# EAGLE design ton1 (EAGLE 7.4.0)
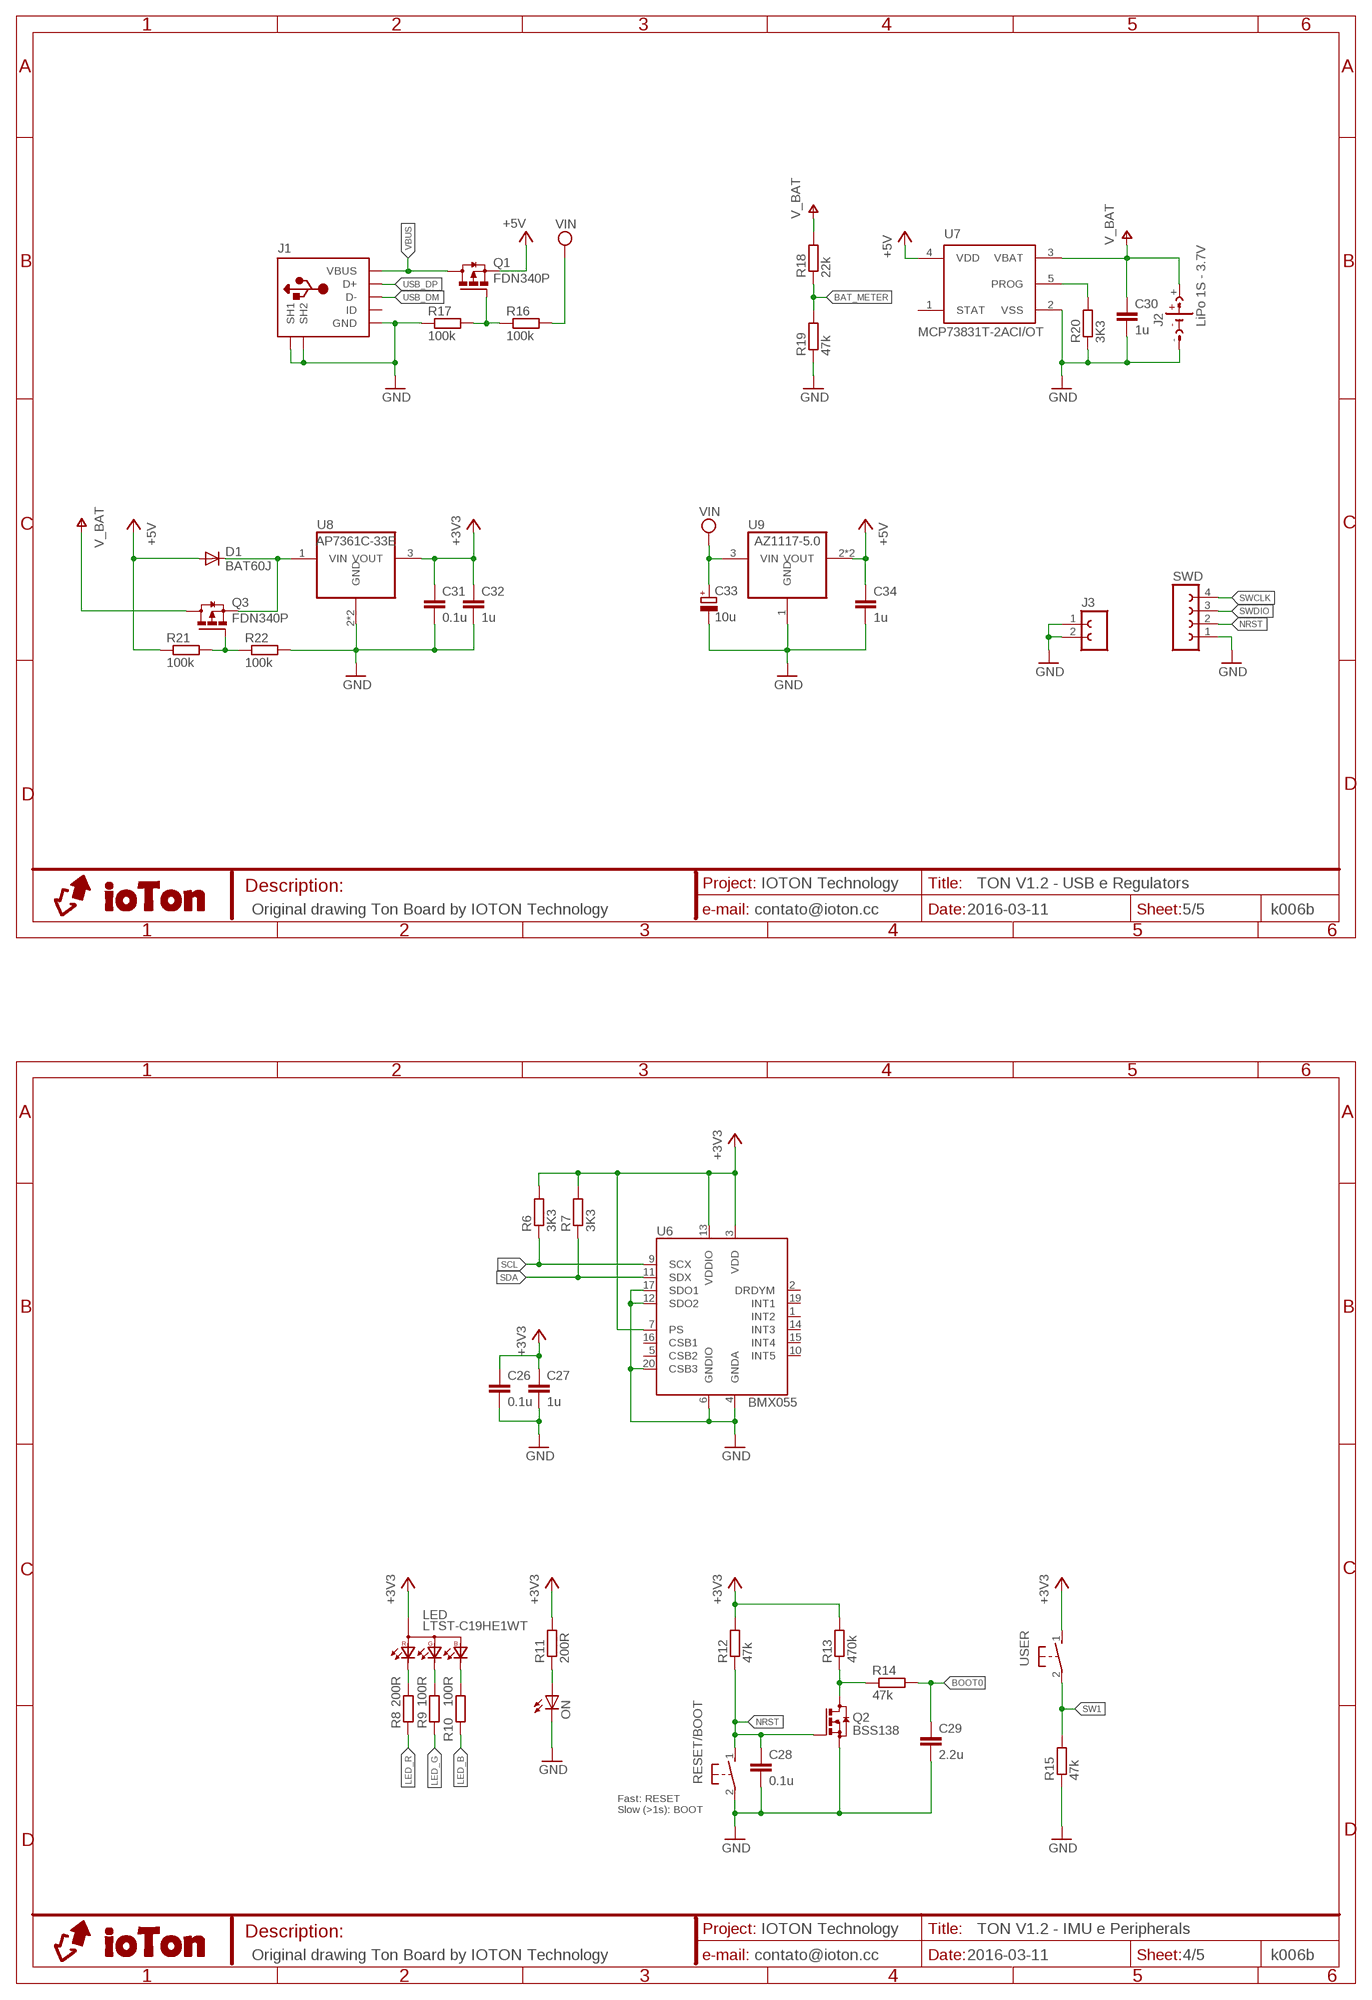
[diagram p0: schematic, sheet 1, part 1 of 3]
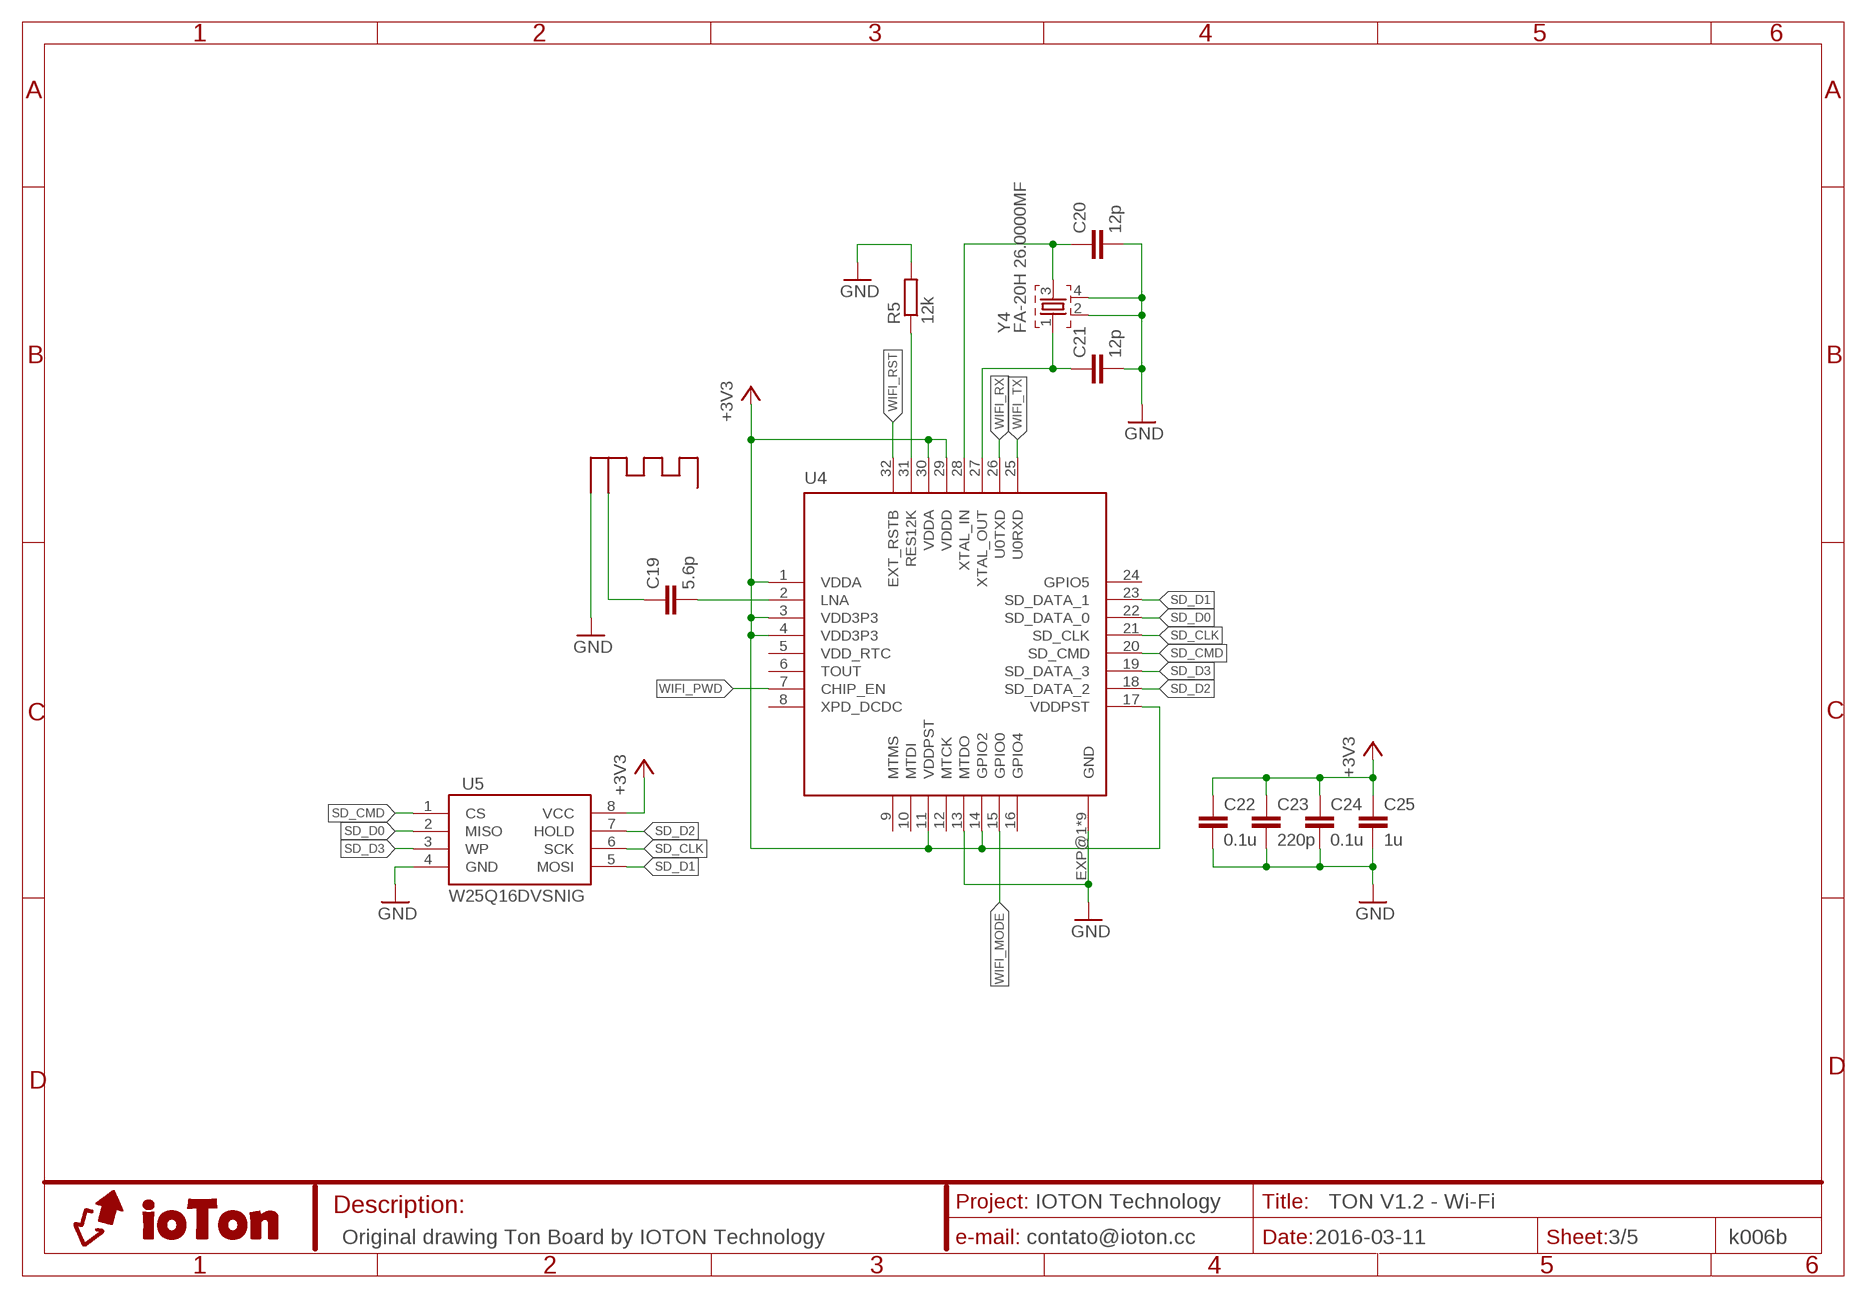
[diagram p1: schematic, sheet 1, part 2 of 3]
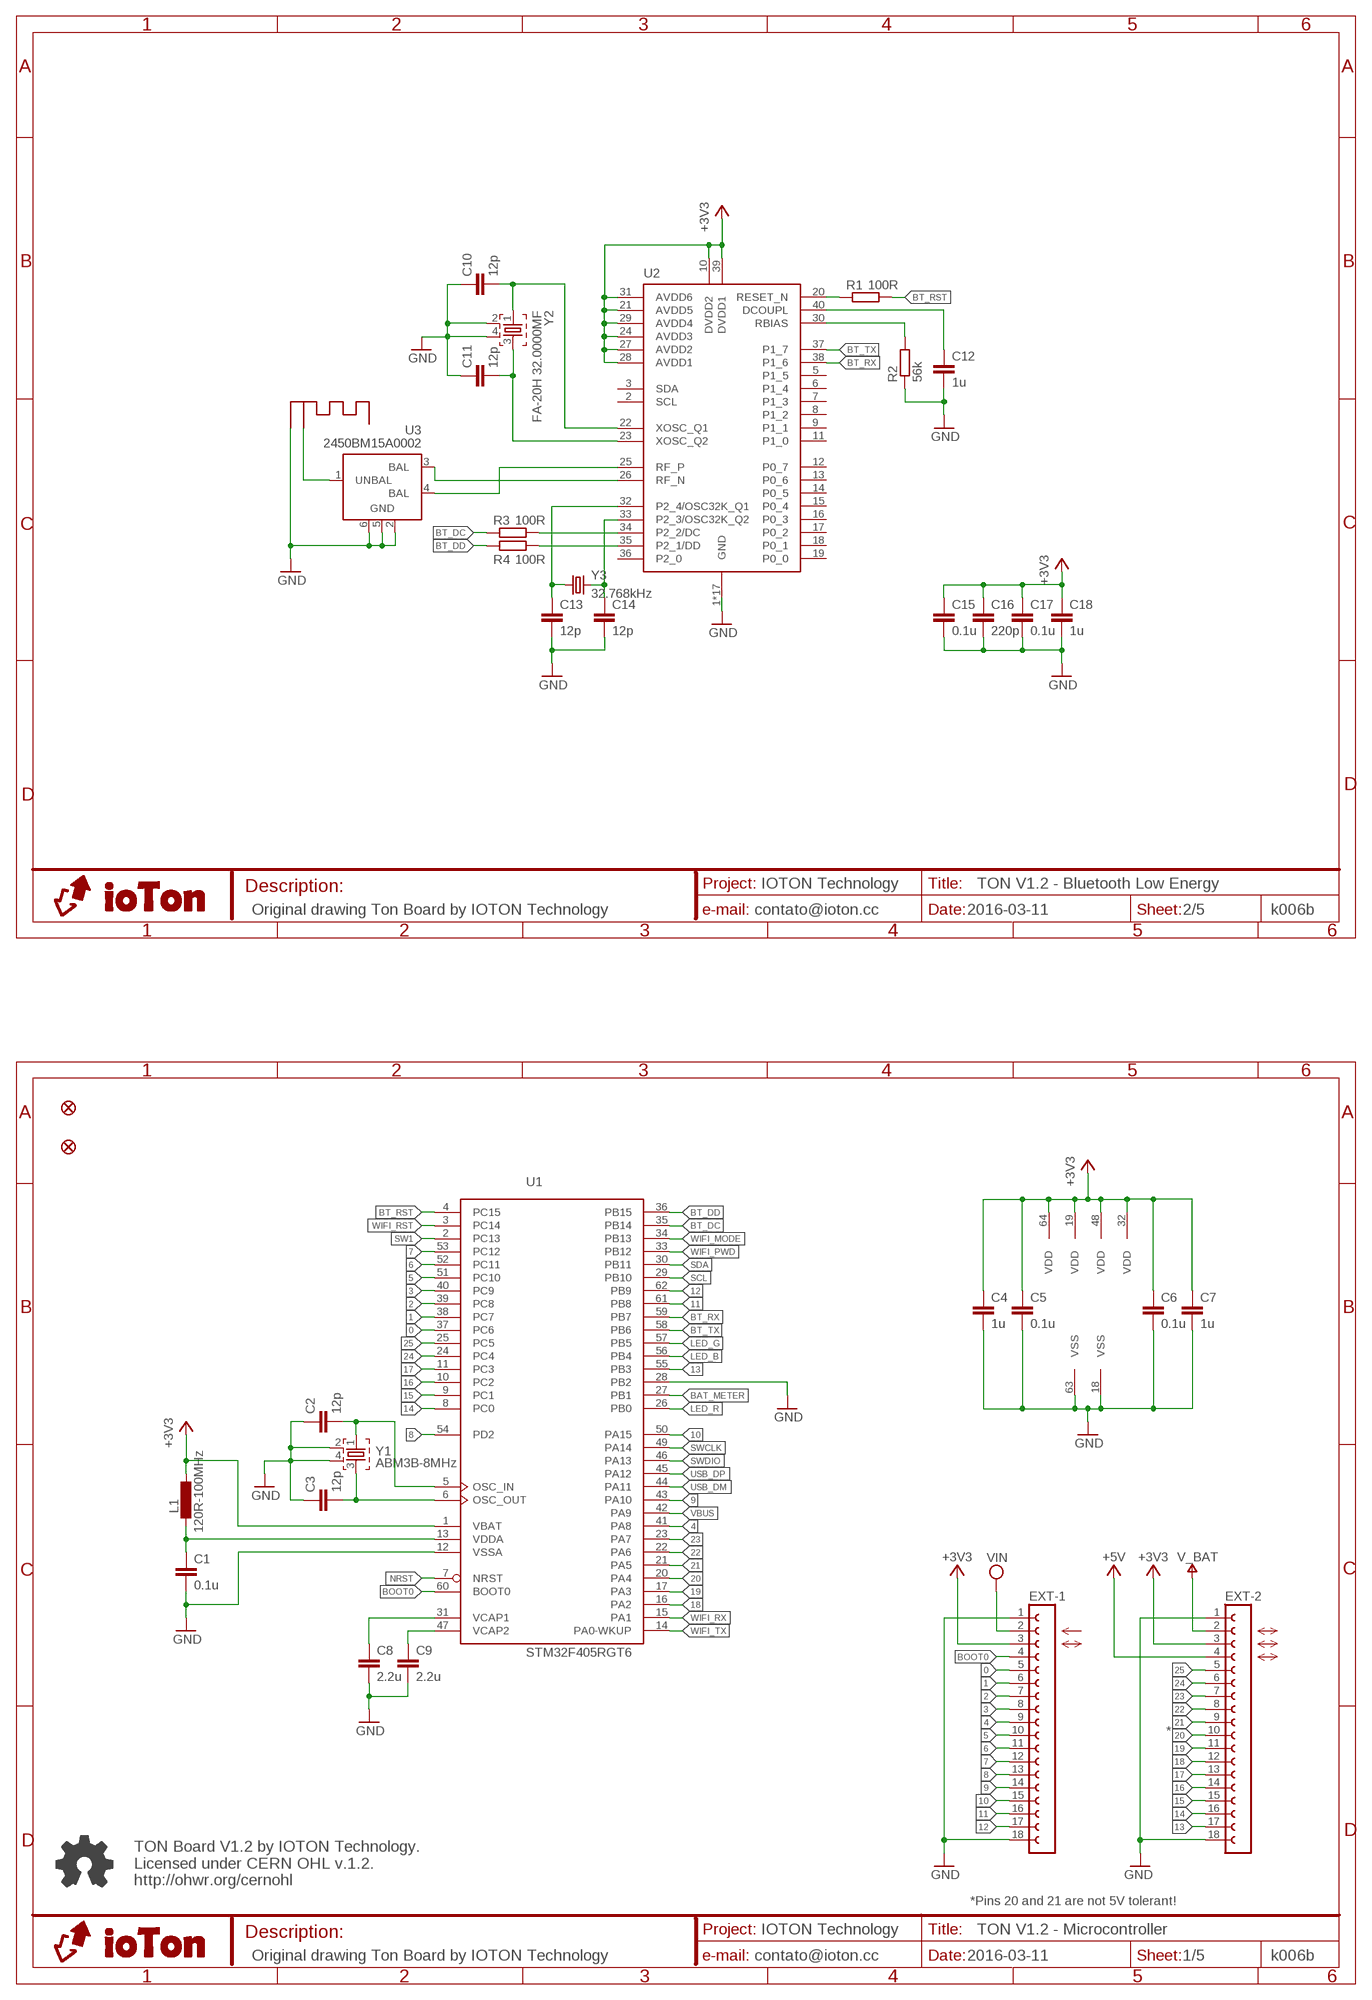
[diagram p2: schematic, sheet 1, part 3 of 3]

## Parts
C1  0.1u  C-EUC0603  [C0603]
C2  12p  C-EUC0402  [C0402]
C3  12p  C-EUC0402  [C0402]
C4  1u  C-EUC0603  [C0603]
C5  0.1u  C-EUC0603  [C0603]
C6  0.1u  C-EUC0603  [C0603]
C7  1u  C-EUC0603  [C0603]
C8  2.2u  C-EUC0603  [C0603]
C9  2.2u  C-EUC0603  [C0603]
C10  12p  C-EUC0402  [C0402]
C11  12p  C-EUC0402  [C0402]
C12  1u  C-EUC0402  [C0402]
C13  12p  C-EUC0402  [C0402]
C14  12p  C-EUC0402  [C0402]
C15  0.1u  C-EUC0402  [C0402]
C16  220p  C-EUC0402  [C0402]
C17  0.1u  C-EUC0402  [C0402]
C18  1u  C-EUC0402  [C0402]
C19  5.6p  C-EUC0402  [C0402]
C20  12p  C-EUC0402  [C0402]
C21  12p  C-EUC0402  [C0402]
C22  0.1u  C-EUC0402  [C0402]
C23  220p  C-EUC0402  [C0402]
C24  0.1u  C-EUC0402  [C0402]
C25  1u  C-EUC0402  [C0402]
C26  0.1u  C-EUC0603  [C0603]
C27  1u  C-EUC0603  [C0603]
C28  0.1u  C-EUC0603  [C0603]
C29  2.2u  C-EUC0603  [C0603]
C30  1u  C-EUC0603  [C0603]
C31  0.1u  C-EUC0603  [C0603]
C32  1u  C-EUC0603  [C0603]
C33  10u  CPOL-EUSMCA  [SMC_A]
C34  1u  C-EUC0603  [C0603]
D1  BAT60J  DIODE-SOD323-R  [SOD323-R]
EXT-1  1_18  [1_18]
EXT-2  1_18  [1_18]
J1  USBR  [0475890001]
J2  LiPo 1S - 3.7V  BATTERY  [BATTERY]
J3  1_2  [1_2]
JP1  FIDUCIAL1X2  [FIDUCIAL-1X2]
JP2  FIDUCIAL1X2  [FIDUCIAL-1X2]
L1  120R-100MHz  L-EULR0603  [LR0603]
LED  LTST-C19HE1WT  LED-RGB-AC  [0606]
ON  LEDCHIPLED_0603  [CHIPLED_0603]
Q1  FDN340P  FDN360P  [SUPER-SOT3]
Q2  BSS138  BSS123  [SOT23]
Q3  FDN340P  FDN360P  [SUPER-SOT3]
R1  100R  R-EU_R0402  [R0402]
R2  56k  R-EU_R0402  [R0402]
R3  100R  R-EU_R0402  [R0402]
R4  100R  R-EU_R0402  [R0402]
R5  12k  R-EU_R0402  [R0402]
R6  3K3  R-EU_R0603  [R0603]
R7  3K3  R-EU_R0603  [R0603]
R8  200R  R-EU_R0603  [R0603]
R9  100R  R-EU_R0603  [R0603]
R10  100R  R-EU_R0603  [R0603]
R11  200R  R-EU_R0603  [R0603]
R12  47k  R-EU_R0603  [R0603]
R13  470k  R-EU_R0603  [R0603]
R14  47k  R-EU_R0603  [R0603]
R15  47k  R-EU_R0603  [R0603]
R16  100k  R-EU_R0603  [R0603]
R17  100k  R-EU_R0603  [R0603]
R18  22k  R-EU_R0603  [R0603]
R19  47k  R-EU_R0603  [R0603]
R20  3K3  R-EU_R0603  [R0603]
R21  100k  R-EU_R0603  [R0603]
R22  100k  R-EU_R0603  [R0603]
RESET/BOOT  SWITCH  [SW_TL-3330]
SWD  FE04-11  [CON4-1_1]
U1  STM32F405RGT6  STM32F405RGT  [LQFP64]
U2  CC2541  [QFN40-6X6]
U3  2450BM15A0002  [2450BM15A0002]
U4  ESP8266O  [QFN32-5X5-O]
U5  W25Q16DVSNIG  SPI_FLASH-X25XXSMD  [SO08]
U6  BMX055  [LGA20-4.5X3]
U7  MCP73831T-2ACI/OT  MCP73831/OT  [SOT23-5L]
U8  AP7361C-33E  LDO-IGO  [SOT223]
U9  AZ1117-5.0  LM1117  [SOT223]
U$1  ANT_PCBR  [ANT_MIFA_R]
U$2  ANT_PCBL  [ANT_MIFA_L]
USER  SWITCH  [SW_TL-3330]
Y1  ABM3B-8MHz  FA-ABM3B  [ABM3B]
Y2  FA-20H 32.0000MF  FA-20H  [FA-20H]
Y3  32.768kHz  CRYSTAL_32.768K  [3.2X1.5]
Y4  FA-20H 26.0000MF  FA-20H  [FA-20H]

## Nets
0: EXT-1.5 U1.37(PC6)
1: EXT-1.6 U1.38(PC7)
2: EXT-1.7 U1.39(PC8)
3: EXT-1.8 U1.40(PC9)
4: EXT-1.9 U1.41(PA8)
5: EXT-1.10 U1.51(PC10)
6: EXT-1.11 U1.52(PC11)
7: EXT-1.12 U1.53(PC12)
8: EXT-1.13 U1.54(PD2)
9: EXT-1.14 U1.43(PA10)
10: EXT-1.15 U1.50(PA15)
11: EXT-1.16 U1.61(PB8)
12: EXT-1.17 U1.62(PB9)
13: EXT-2.17 U1.55(PB3)
14: EXT-2.16 U1.8(PC0)
15: EXT-2.15 U1.9(PC1)
16: EXT-2.14 U1.10(PC2)
17: EXT-2.13 U1.11(PC3)
18: EXT-2.12 U1.16(PA2)
19: EXT-2.11 U1.17(PA3)
20: EXT-2.10 U1.20(PA4)
21: EXT-2.9 U1.21(PA5)
22: EXT-2.8 U1.22(PA6)
23: EXT-2.7 U1.23(PA7)
24: EXT-2.6 U1.24(PC4)
25: EXT-2.5 U1.25(PC5)
+3V3: C4.1 C5.1 C6.1 C7.1 C15.1 C16.1 C17.1 C18.1 C22.1 C23.1 C24.1 C25.1 C26.1 C27.1 C31.1 C32.1 EXT-1.3 EXT-2.3 L1.2 LED.4(A) R6.2 R7.2 R11.2 R12.2 R13.2 U1.1(VBAT) U1.19(VDD) U1.32(VDD) U1.48(VDD) U1.64(VDD) U2.10(DVDD2) U2.21(AVDD5) U2.24(AVDD3) U2.27(AVDD2) U2.28(AVDD1) U2.29(AVDD4) U2.31(AVDD6) U2.39(DVDD1) U4.1(VDDA) U4.3(VDD3P3) U4.4(VDD3P3) U4.11(VDDPST) U4.14(GPIO2) U4.17(VDDPST) U4.29(VDDD) U4.30(VDDA) U5.8(VCC) U6.3(VDD) U6.7(PS) U6.13(VDDIO) U8.3(VOUT) USER.1
+5V: C34.1 D1.A EXT-2.4 Q1.2(S) R21.1 U7.4(VDD) U9.2(VOUT) U9.4(VOUT)
BAT_METER: R18.1 R19.2 U1.27(PB1)
BOOT0: C29.1 EXT-1.4 R14.2 U1.60(BOOT0)
BT_ANT: U3.1(UNBAL) U$2.ANT
BT_DC: R3.1 U1.35(PB14)
BT_DD: R4.1 U1.36(PB15)
BT_RST: R1.2 U1.4(PC15)
BT_RX: U1.59(PB7) U2.38(P1_6)
BT_TX: U1.58(PB6) U2.37(P1_7)
GND: C1.2 C2.1 C3.1 C4.2 C5.2 C6.2 C7.2 C8.2 C9.2 C10.1 C11.1 C12.2 C13.2 C14.2 C15.2 C16.2 C17.2 C18.2 C20.2 C21.2 C22.2 C23.2 C24.2 C25.2 C26.2 C27.2 C28.2 C29.2 C30.2 C31.2 C32.2 C33.- C34.2 EXT-1.1 EXT-1.18 EXT-2.1 EXT-2.18 J1.5(GND) J1.SH1 J1.SH2(SH1) J1.SH3(SH2) J1.SH4(SH2) J1.SH5(SH1) J1.SH6(SH2) J2.- J3.1 J3.2 ON.C Q2.2(S) R2.1 R5.2 R15.1 R17.1 R19.1 R20.1 R22.2 RESET/BOOT.2 SWD.1 U1.12(VSSA) U1.18(VSS) U1.28(PB2) U1.63(VSS) U2.1(GND) U2.EXP@1(GND) U2.EXP@2(GND) U2.EXP@3(GND) U2.EXP@4(GND) U2.EXP@5(GND) U2.EXP@6(GND) U2.EXP@7(GND) U2.EXP@8(GND) U2.EXP@9(GND) U2.EXP@10(GND) U2.EXP@11(GND) U2.EXP@12(GND) U2.EXP@13(GND) U2.EXP@14(GND) U2.EXP@15(GND) U2.EXP@16(GND) U3.2(GND) U3.5(GND) U3.6(GND) U4.13(MTDO) U4.EXP@1(GND) U4.EXP@2(GND) U4.EXP@3(GND) U4.EXP@5(GND) U4.EXP@6(GND) U4.EXP@7(GND) U4.EXP@9(GND) U4.EXP@10(GND) U4.EXP@11(GND) U5.4(GND) U6.4(GNDA) U6.6(GNDIO) U6.12(SDO2) U6.17(SDO1) U6.20(CSB3) U7.2(VSS) U8.2(GND) U8.4(GND) U9.1(GND) U$1.GND U$2.GND Y1.2 Y1.4 Y2.2 Y2.4 Y4.2 Y4.4
LED_B: R10.1 U1.56(PB4)
LED_G: R9.1 U1.57(PB5)
LED_R: R8.1 U1.26(PB0)
N$1: C2.2 U1.5(OSC_IN) Y1.1
N$2: C3.2 U1.6(OSC_OUT) Y1.3
N$3: C13.1 U2.32(P2_4/OSC32K_Q1) Y3.1
N$4: LED.1(KRED) R8.2
N$5: C8.1 U1.31(VCAP1)
N$6: C9.1 U1.47(VCAP2)
N$7: LED.2(KGREEN) R9.2
N$8: LED.3(KBLUE) R10.2
N$9: C1.1 L1.1 U1.13(VDDA)
N$10: R5.1 U4.31(RES12K)
N$11: C21.1 U4.27(XTAL_OUT) Y4.1
N$12: U2.26(RF_N) U3.3(BAL)
N$13: R2.2 U2.30(RBIAS)
N$14: C12.1 U2.40(DCOUPL)
N$15: U2.25(RF_P) U3.4(BAL)
N$16: R3.2 U2.34(P2_2/DC)
N$17: C20.1 U4.28(XTAL_IN) Y4.3
N$18: R20.2 U7.5(PROG)
N$19: C10.2 U2.22(XOSC_Q1) Y2.1
N$20: C11.2 U2.23(XOSC_Q2) Y2.3
N$21: R4.2 U2.35(P2_1/DD)
N$22: R1.1 U2.20(RESET_N)
N$23: C19.2 U4.2(LNA)
N$24: C14.1 U2.33(P2_3/OSC32K_Q2) Y3.2
N$25: ON.A R11.1
N$26: Q1.1(G) R16.1 R17.2
N$27: Q2.3(D) R13.1 R14.1
N$28: Q3.1(G) R21.2 R22.1
NRST: C28.1 Q2.1(G) R12.1 RESET/BOOT.1 SWD.2 U1.7(NRST)
SCL: R6.1 U1.29(PB10) U6.9(SCX)
SD_CLK: U4.21(SD_CLK) U5.6(SCK)
SD_CMD: U4.20(SD_CMD) U5.1(CS)
SD_D0: U4.22(SD_DATA_0) U5.2(MISO)
SD_D1: U4.23(SD_DATA_1) U5.5(MOSI)
SD_D2: U4.18(SD_DATA_2) U5.7(HOLD)
SD_D3: U4.19(SD_DATA_3) U5.3(WP)
SDA: R7.1 U1.30(PB11) U6.11(SDX)
SW1: R15.2 U1.2(PC13) USER.2
SWCLK: SWD.4 U1.49(PA14)
SWDIO: SWD.3 U1.46(PA13)
USB_DM: J1.2(D-) U1.44(PA11)
USB_DP: J1.3(D+) U1.45(PA12)
V+: C30.1 EXT-2.2 J2.+ Q3.3(D) R18.2 U7.3(VBAT) ; supply symbol labelled V_BAT
VBUS: J1.1(VBUS) Q1.3(D) U1.42(PA9)
VIN_3V3: D1.C Q3.2(S) U8.1(VIN)
VPP: C33.+ EXT-1.2 R16.2 U9.3(VIN) ; supply symbol labelled VIN
WIFI_ANT: C19.1 U$1.ANT
WIFI_MODE: U1.34(PB13) U4.15(GPIO0)
WIFI_PWD: U1.33(PB12) U4.7(CHIP_EN)
WIFI_RST: U1.3(PC14) U4.32(EXT_RSTB)
WIFI_RX: U1.15(PA1) U4.26(U0TXD)
WIFI_TX: U1.14(PA0-WKUP) U4.25(U0RXD)
Unconnected: J1.4(ID) U2.2(SCL) U2.3(SDA) U2.5(P1_5) U2.6(P1_4) U2.7(P1_3) U2.8(P1_2) U2.9(P1_1) U2.11(P1_0) U2.12(P0_7) U2.13(P0_6) U2.14(P0_5) U2.15(P0_4) U2.16(P0_3) U2.17(P0_2) U2.18(P0_1) U2.19(P0_0) U2.36(P2_0) U4.6(TOUT) U4.8(XPD_DCDC) U4.9(MTMS) U4.10(MTDI) U4.12(MTCK) U4.16(GPIO4) U4.24(GPIO5) U6.1(INT2) U6.2(DRDYM) U6.5(CSB2) U6.10(INT5) U6.14(INT3) U6.15(INT4) U6.16(CSB1) U6.19(INT1) U7.1(STAT)

## Notes on the sheet
- TON V1.2 - USB e Regulators
- Original drawing Ton Board by IOTON Technology | k006b
- Fast: RESET
  Slow (>1s): BOOT
- TON V1.2 - IMU e Peripherals
- Original drawing Ton Board by IOTON Technology | k006b
- TON V1.2 - Wi-Fi
- Original drawing Ton Board by IOTON Technology | k006b
- TON V1.2 - Bluetooth Low Energy
- Original drawing Ton Board by IOTON Technology | k006b
- *
- TON Board V1.2 by IOTON Technology.
  Licensed under CERN OHL v.1.2.
  http://ohwr.org/cernohl
- *Pins 20 and 21 are not 5V tolerant!
- TON V1.2 - Microcontroller
- Original drawing Ton Board by IOTON Technology | k006b

## Power pins joined to a net without a drawn wire
VDD_RTC: U4.5(VDD_RTC)

## Library data of the parts
C1-C32 C34 = rcl:C-EU: CAPACITOR, European symbol
C33 = rcl:CPOL-EU: POLARIZED CAPACITOR, European symbol
D1 = diode:DIODE-: DIODE
EXT-1 EXT-2 = ioton:1_18
J1 = ioton:USB: Hirose MicroUSB A/B Connector
J2 = pololu:BATTERY: BATTERY CLIP
J3 = ioton:1_2
JP1 JP2 = SparkFun:FIDUCIAL: Fiducial Alignment Points Various fiducial points for machine vision alignment.
L1 = rcl:L-EU: INDUCTOR, European symbol
LED = pololu:LED-RGB-AC
ON = led:LED: LED OSRAM: - CHIPLED LG R971, LG N971, LY N971, LG Q971, LY Q971, LO R971, LY R971 LH N974, LH R974 LS Q976, LO Q976, LY Q976 LO Q996 - Hyper CHIPLED LW Q18S LB Q993, LB Q99A, LB R99A - SideLED LS A670, LO A670, LY A670, LG A670, LP A670 LB A673, LV A673, LT A673, LW A673 LH A674 LY A675 LS A676, LA A676, LO A676, LY A676, LW A676 LS A679, LY A679, LG A679 - Hyper Micro SIDELED® LS Y876, LA Y876, LO Y876, LY Y876 LT Y87S - SmartLED LW L88C, LW L88S LB L89C, LB L89S, LG L890 LS L89K, LO L89K, LY L89K LS L896, LA L896, LO L896, LY L896 - TOPLED LS T670, LO T670, LY T670, LG T670, LP T670 LSG T670, LSP T670, LSY T670, LOP T670, LYG T670 LG T671, LOG T671, LSG T671 LB T673, LV T673, LT T673, LW T673 LH T674 LS T676, LA T676, LO T676, LY T676, LB T676, LH T676, LSB T676, LW T676 LB T67C, LV T67C, LT T67C, LS T67K, LO T67K, LY T67K, LW E67C LS E67B, LA E67B, LO E67B, LY E67B, LB E67C, LV E67C, LT E67C LW T67C LS T679, LY T679, LG T679 LS T770, LO T770, LY T770, LG T770, LP T770 LB T773, LV T773, LT T773, LW T773 LH T774 LS E675, LA E675, LY E675, LS T675 LS T776, LA T776, LO T776, LY T776, LB T776 LHGB T686 LT T68C, LB T68C - Hyper Mini TOPLED® LB M676 - Mini TOPLED Santana® LG M470 LS M47K, LO M47K, LY M47K Source: http://www.osram.convergy.de LUXEON: - LUMILED® LXK2-PW12-R00, LXK2-PW12-S00, LXK2-PW14-U00, LXK2-PW14-V00 LXK2-PM12-R00, LXK2-PM12-S00, LXK2-PM14-U00 LXK2-PE12-Q00, LXK2-PE12-R00, LXK2-PE12-S00, LXK2-PE14-T00, LXK2-PE14-U00 LXK2-PB12-K00, LXK2-PB12-L00, LXK2-PB12-M00, LXK2-PB14-N00, LXK2-PB14-P00, LXK2-PB14-Q00 LXK2-PR12-L00, LXK2-PR12-M00, LXK2-PR14-Q00, LXK2-PR14-R00 LXK2-PD12-Q00, LXK2-PD12-R00, LXK2-PD12-S00 LXK2-PH12-R00, LXK2-PH12-S00 LXK2-PL12-P00, LXK2-PL12-Q00, LXK2-PL12-R00 Source: www.luxeon.com KINGBRIGHT: KA-3528ASYC Source: www.kingbright.com
Q1 Q3 = transistor-power:FDN360P: Single P-Channel, PowerTrench (R) MOSFET Source: http://www.fairchildsemi.com/ds/FD/FDN360P.pdf
Q2 = transistor-small-signal:BSS123: N-CHANNEL MOS FET
R1-R22 = rcl:R-EU_: RESISTOR, European symbol
RESET/BOOT USER = ioton:SWITCH
SWD = pololu:FE04-1
U1 = micro-stm_v2:STM32F405R*T: ARM 32-bit Cortex™-M3 CPU 168 MHz maximum frequency 1024 Kbytes of Flash memory 192 kbytes of SRAM 51 GPIOs 1.8 to 3.6 V application supply
U2 = ioton:CC2541
U3 = johanson-technology:2450BM15A0002: 2.45 GHz Impedance Matched Balun-Filter For TI CC253X/CC2540 Chipset family Data sheet <http://www.johansontechnology.com/images/stories/ip/baluns/balun_filter_combo_matched_2450bm15a0002_v8.pdf>
U4 = ioton:ESP8266
U5 = SparkFun:SPI_FLASH-X25XX: 8pin SPI Flash series x25xx. Works with devices like W25X32 and BR25L32
U6 = ioton:BMX055
U7 = adafruit:MCP73831: MCP73831/2 Miniature Single-Cell, Fully Integrated Li-Ion, Li-Polymer Charge Management Controllers. Nice and small simple lipoly charge controller, with adjustable current and status output (LED) http://www.ladyada.net/library/pcb/eaglelibrary.html
U8 = pololu:LDO-IGO
U9 = pololu:LM1117: 800mA and 1A Low Dropout (LDO) Positive Regulator 1.8V, 2.5V, 2.85V, 3.3V, 5V, and Adj; MPN: REG1117; OC_FARNELL: 1097566; OC_NEWARK: 14P6981
U$1 U$2 = ioton:ANT_PCB
Y1 = ioton:FA-: MHz RANGE CRYSTAL UNIT Source: Epson Toyocom
Y2 Y4 = crystal:FA-: MHz RANGE CRYSTAL UNIT Source: Epson Toyocom
Y3 = ioton:CRYSTAL_32.768K

## Board
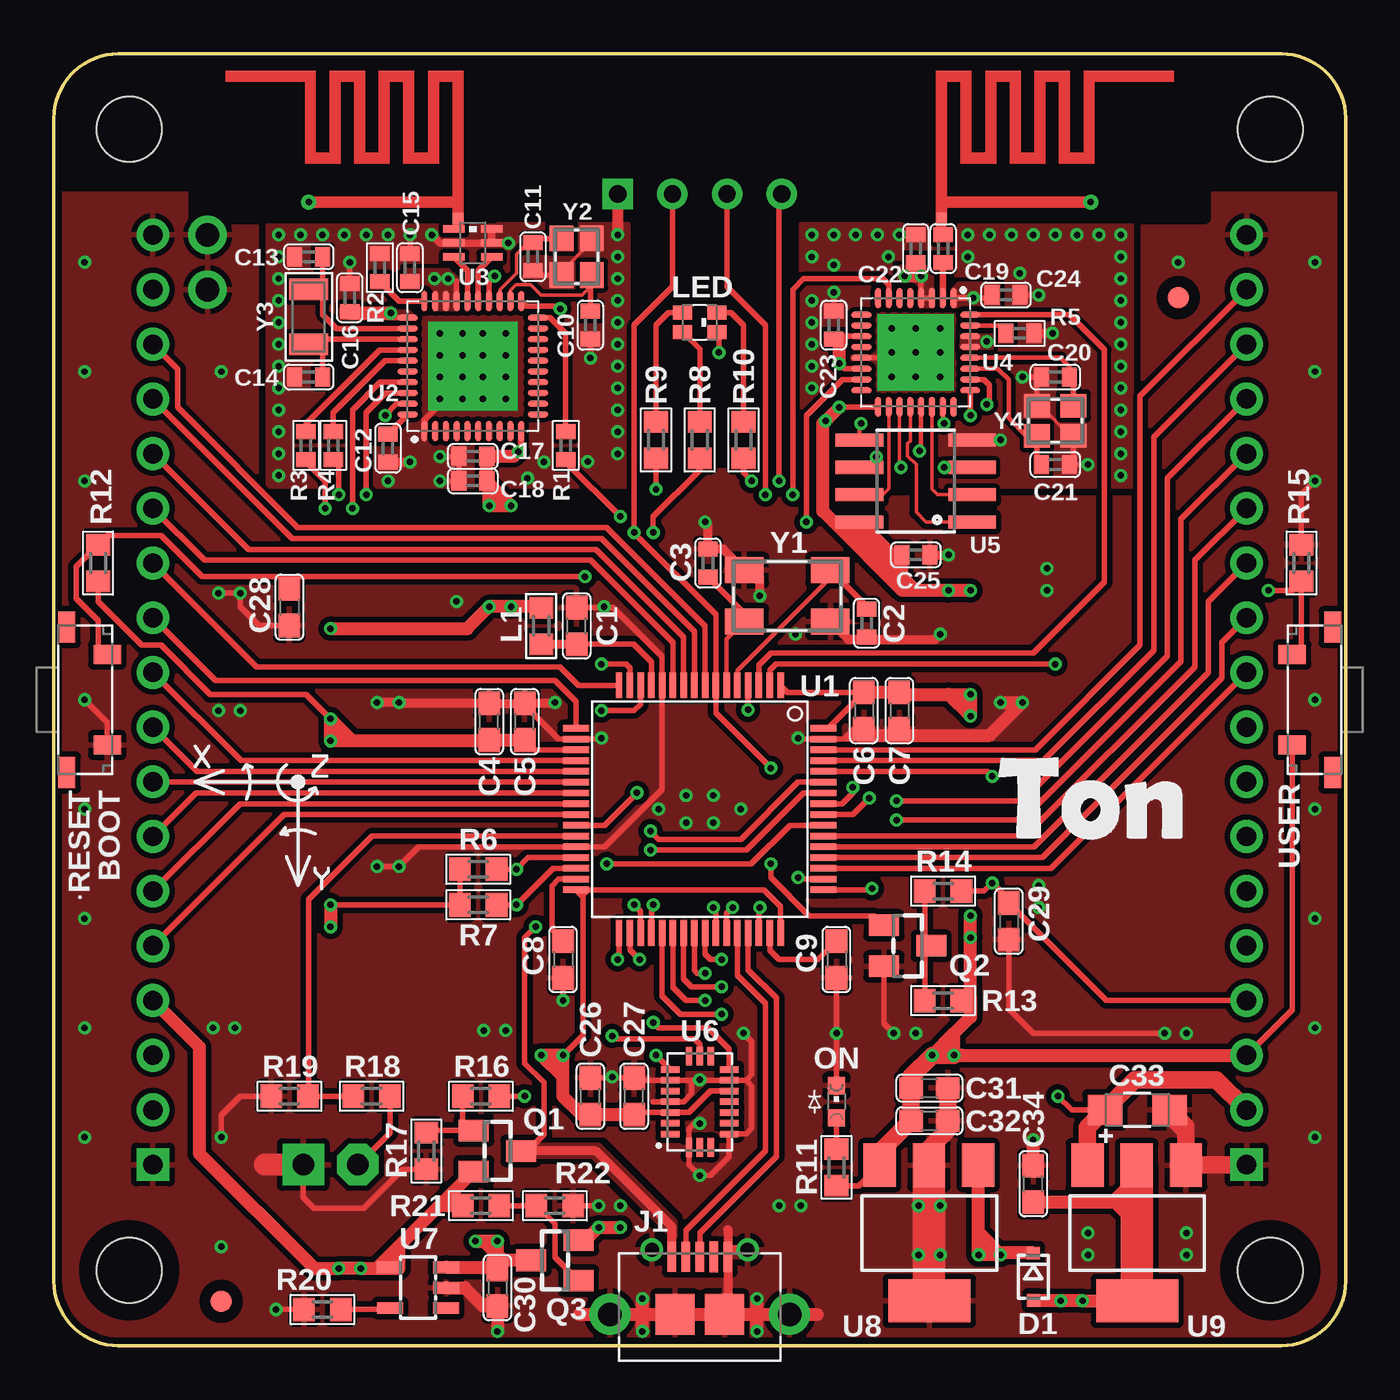
[diagram p3: board, top side]
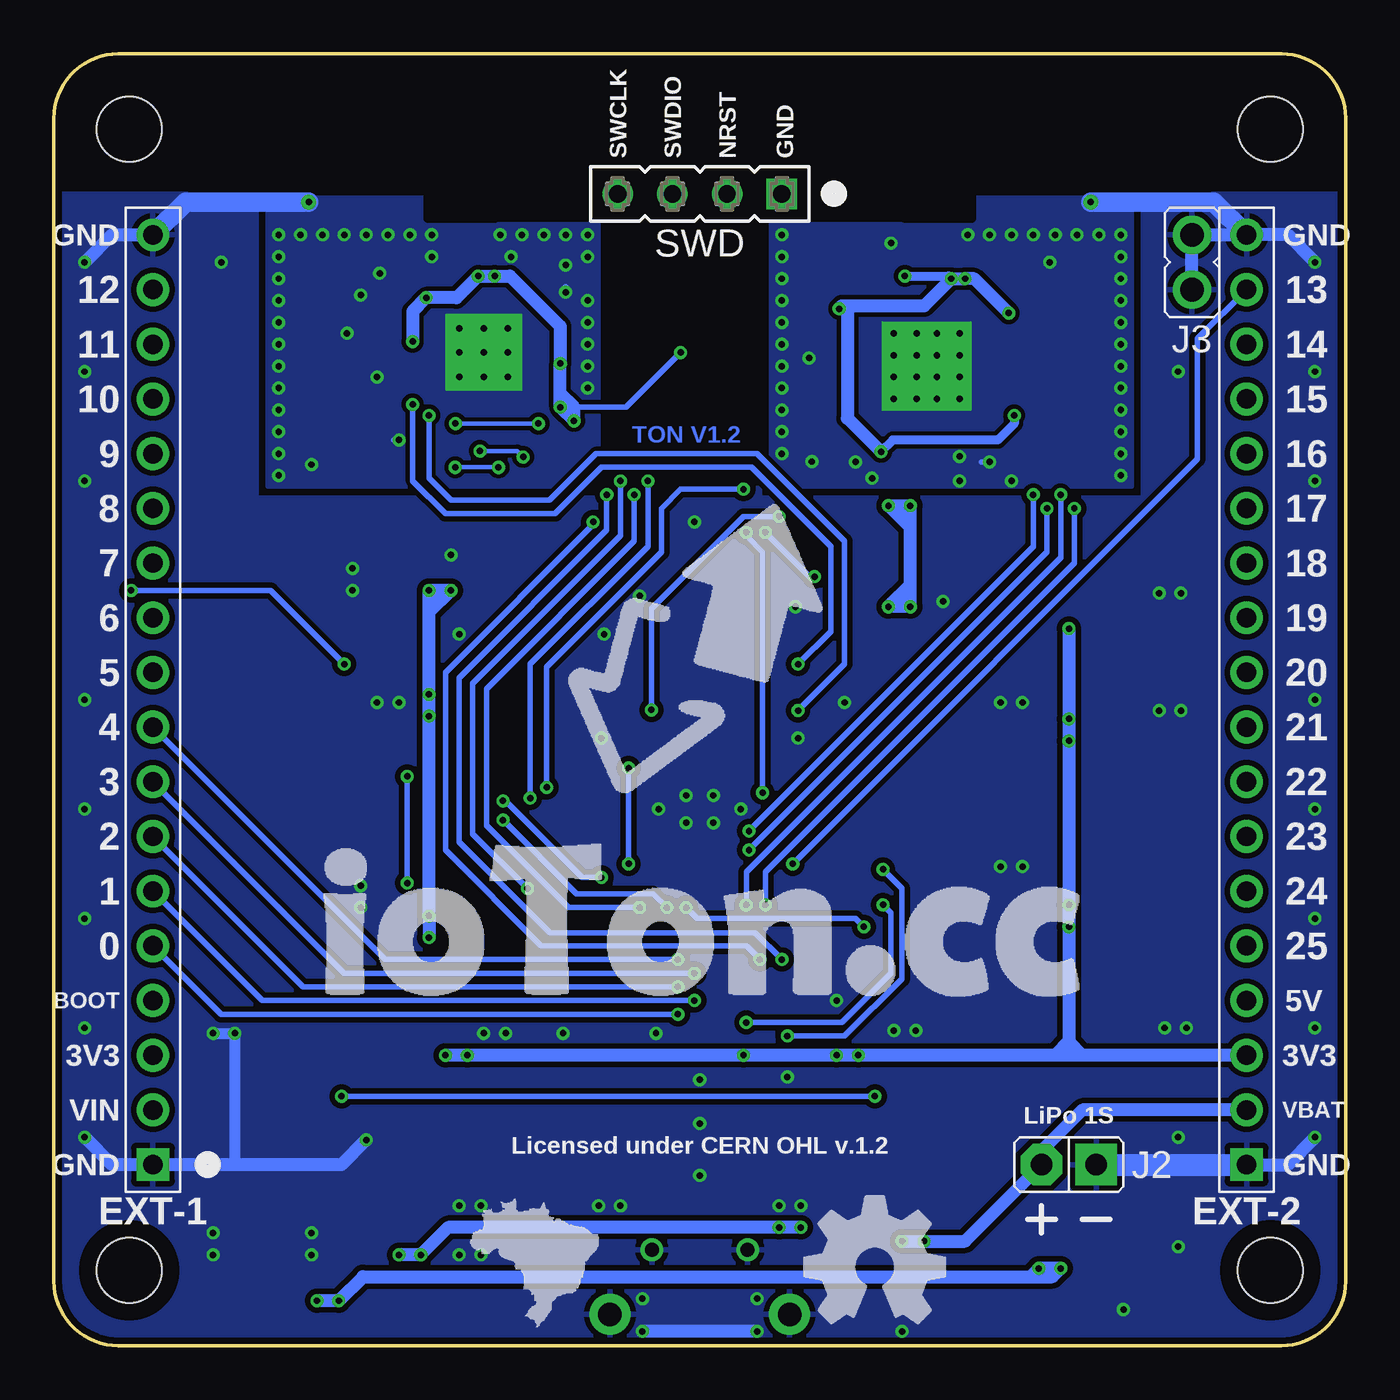
[diagram p4: board, bottom side, seen from below]

Size 60 x 60 mm. Coordinates in mm from the lower left corner, seen from the top.
Outline: 57,0 3,0 arc-90 0,3 0,57 arc-90 3,60 57,60 arc-90 60,57 60,3 arc-90 57,0
Copper layers (1*16): Top 0.035mm / dielectric 1.5mm / Bottom 0.035mm
Design rules "default *": minimum track width 6mil, minimum drill 10mil, track to track 8mil, track to pad 7mil, pad to pad 6mil, via to via 7mil, smd to smd 0mil, copper to edge 12mil, drill to drill 8mil, minimum pad ring 8mil, minimum via ring 6mil, stop-mask expansion 4mil, vias tented up to drill 19mil, thermal gap 10mil
Holes 3 mm at 3.5,3.5 3.5,56.5 56.5,56.5 56.5,3.5
tRestrict: area 1.5,1.5 to 5.5,5.5; area 54.5,1.5 to 58.5,5.5; area 51.5,47.9 to 53,49.4; area 7,1.3 to 8.5,2.8
bRestrict: area 1.5,1.5 to 5.5,5.5; area 54.5,1.5 to 58.5,5.5

### Footprints (pad centres in the part's own frame; a part is rotated, then mirrored left to right if it is on the bottom)
C0603 = smd 1.1 x 1: 1 -0.85,0; 2 0.85,0
C0402 = smd 0.7 x 0.9: 1 -0.65,0; 2 0.65,0
SMC_A = smd 1.6 x 1.4: + -1.5,0; - 1.5,0
SOD323-R = smd 0.6 x 0.6: A 1.1,0; C -1.1,0
1_18 = drill 0.9 pad 1.524 square: 1 -21.59,0 | drill 0.9 pad 1.524: 2 -19.05,0; 3 -16.51,0; 4 -13.97,0; 5 -11.43,0; 6 -8.89,0; 7 -6.35,0; 8 -3.81,0; 9 -1.27,0; 10 1.27,0; 11 3.81,0; 12 6.35,0; 13 8.89,0; 14 11.43,0; 15 13.97,0; 16 16.51,0; 17 19.05,0; 18 21.59,0
0475890001 = smd 0.4 x 1.4: 1 -1.3,2.675; 2 -0.65,2.675; 3 0,2.675; 4 0.65,2.675; 5 1.3,2.675 | drill 1.1 pad 1.9: SH1 -4.175,0; SH4 4.175,0 | smd 1.8 x 1.9: SH2 -1.15,0; SH3 1.15,0 | drill 0.65 pad 1.05: SH5 -2.225,3; SH6 2.225,3
BATTERY = drill 1 pad 1.93 octagon: + 0,1.27 | drill 1 pad 1.93 square: - 0,-1.27
1_2 = drill 1.1 pad 1.778: 1 -1.27,0; 2 1.27,0
FIDUCIAL-1X2 = smd 1 x 1: 1 0,0
LR0603 = smd 1 x 1.1: 1 -0.85,0; 2 0.85,0
0606 = smd 0.65 x 0.9: 1 -0.45,0.8; 2 0.45,0.8; 3 0.45,-0.8; 4 -0.45,-0.8
CHIPLED_0603 = smd 0.8 x 0.8: A 0,-0.75; C 0,0.75
SUPER-SOT3 = smd 1 x 1.4: 1 -0.95,-1.1; 2 0.95,-1.1; 3 0,1.1
SOT23 = smd 1 x 1.4: 1 -0.95,-1.1; 2 0.95,-1.1; 3 0,1.1
R0402 = smd 0.7 x 0.9: 1 -0.65,0; 2 0.65,0
R0603 = smd 1 x 1.1: 1 -0.85,0; 2 0.85,0
SW_TL-3330 = smd 0.9 x 1.27: 1 -2.1,0.885; 2 2.1,0.885 | smd 1.45 x 0.8: 3 -3.375,-1; 4 3.375,-1
CON4-1_1 = drill 0.8 pad 1.422 square: 1 -3.81,0 | drill 0.8 pad 1.422: 2 -1.27,0; 3 1.27,0; 4 3.81,0
LQFP64 = smd 0.3 x 1.2: 1 -3.75,-5.75; 2 -3.25,-5.75; 3 -2.75,-5.75; 4 -2.25,-5.75; 5 -1.75,-5.75; 6 -1.25,-5.75; 7 -0.75,-5.75; 8 -0.25,-5.75; 9 0.25,-5.75; 10 0.75,-5.75; 11 1.25,-5.75; 12 1.75,-5.75; 13 2.25,-5.75; 14 2.75,-5.75; 15 3.25,-5.75; 16 3.75,-5.75; 33 3.75,5.75; 34 3.25,5.75; 35 2.75,5.75; 36 2.25,5.75; 37 1.75,5.75; 38 1.25,5.75; 39 0.75,5.75; 40 0.25,5.75; 41 -0.25,5.75; 42 -0.75,5.75; 43 -1.25,5.75; 44 -1.75,5.75; 45 -2.25,5.75; 46 -2.75,5.75; 47 -3.25,5.75; 48 -3.75,5.75 | smd 1.2 x 0.3: 17 5.75,-3.75; 18 5.75,-3.25; 19 5.75,-2.75; 20 5.75,-2.25; 21 5.75,-1.75; 22 5.75,-1.25; 23 5.75,-0.75; 24 5.75,-0.25; 25 5.75,0.25; 26 5.75,0.75; 27 5.75,1.25; 28 5.75,1.75; 29 5.75,2.25; 30 5.75,2.75; 31 5.75,3.25; 32 5.75,3.75; 49 -5.75,3.75; 50 -5.75,3.25; 51 -5.75,2.75; 52 -5.75,2.25; 53 -5.75,1.75; 54 -5.75,1.25; 55 -5.75,0.75; 56 -5.75,0.25; 57 -5.75,-0.25; 58 -5.75,-0.75; 59 -5.75,-1.25; 60 -5.75,-1.75; 61 -5.75,-2.25; 62 -5.75,-2.75; 63 -5.75,-3.25; 64 -5.75,-3.75
QFN40-6X6 = smd 0.95 x 0.28: 1 -3.025,2.25; 2 -3.025,1.75; 3 -3.025,1.25; 4 -3.025,0.75; 5 -3.025,0.25; 6 -3.025,-0.25; 7 -3.025,-0.75; 8 -3.025,-1.25; 9 -3.025,-1.75; 10 -3.025,-2.25; 21 3.025,-2.25; 22 3.025,-1.75; 23 3.025,-1.25; 24 3.025,-0.75; 25 3.025,-0.25; 26 3.025,0.25; 27 3.025,0.75; 28 3.025,1.25; 29 3.025,1.75; 30 3.025,2.25 | smd 0.28 x 0.95: 11 -2.25,-3.025; 12 -1.75,-3.025; 13 -1.25,-3.025; 14 -0.75,-3.025; 15 -0.25,-3.025; 16 0.25,-3.025; 17 0.75,-3.025; 18 1.25,-3.025; 19 1.75,-3.025; 20 2.25,-3.025; 31 2.25,3.025; 32 1.75,3.025; 33 1.25,3.025; 34 0.75,3.025; 35 0.25,3.025; 36 -0.25,3.025; 37 -0.75,3.025; 38 -1.25,3.025; 39 -1.75,3.025; 40 -2.25,3.025 | drill 0.3 pad 1.1 square: EXP@1 -1.525,1.525; EXP@2 -0.5,1.525; EXP@3 0.5,1.525; EXP@4 1.525,1.525; EXP@5 -1.525,0.475; EXP@6 -0.5,0.475; EXP@7 0.5,0.475; EXP@8 1.525,0.475; EXP@9 -1.525,-0.475; EXP@10 -0.5,-0.475; EXP@11 0.5,-0.475; EXP@12 1.525,-0.475; EXP@13 -1.525,-1.525; EXP@14 -0.5,-1.525; EXP@15 0.5,-1.525; EXP@16 1.525,-1.525
2450BM15A0002 = smd 0.35 x 1: 1 -0.65,-0.875; 2 0,-0.875; 3 0.65,-0.875; 4 0.65,0.875; 5 0,0.875; 6 -0.65,0.875
QFN32-5X5-O = smd 0.95 x 0.28: 1 -2.525,1.75; 2 -2.525,1.25; 3 -2.525,0.75; 4 -2.525,0.25; 5 -2.525,-0.25; 6 -2.525,-0.75; 7 -2.525,-1.25; 8 -2.525,-1.75; 17 2.525,-1.75; 18 2.525,-1.25; 19 2.525,-0.75; 20 2.525,-0.25; 21 2.525,0.25; 22 2.525,0.75; 23 2.525,1.25; 24 2.525,1.75 | smd 0.28 x 0.95: 9 -1.75,-2.525; 10 -1.25,-2.525; 11 -0.75,-2.525; 12 -0.25,-2.525; 13 0.25,-2.525; 14 0.75,-2.525; 15 1.25,-2.525; 16 1.75,-2.525; 25 1.75,2.525; 26 1.25,2.525; 27 0.75,2.525; 28 0.25,2.525; 29 -0.25,2.525; 30 -0.75,2.525; 31 -1.25,2.525; 32 -1.75,2.525 | drill 0.3 pad 1.3 square: EXP@1 -1.125,1.125; EXP@2 0,1.125; EXP@3 1.125,1.125; EXP@5 -1.125,0; EXP@7 1.125,0; EXP@9 -1.125,-1.125; EXP@10 0,-1.125; EXP@11 1.125,-1.125 | drill 0.3 pad 1.1 square: EXP@6 0,0
SO08 = smd 0.61 x 2.21: 1 -1.905,-2.616; 2 -0.635,-2.616; 3 0.635,-2.616; 4 1.905,-2.616; 5 1.905,2.616; 6 0.635,2.616; 7 -0.635,2.616; 8 -1.905,2.616
LGA20-4.5X3 = smd 0.87 x 0.3: 1 1.365,1.5; 2 1.365,1; 3 1.365,0.5; 4 1.365,0; 5 1.365,-0.5; 6 1.365,-1; 7 1.365,-1.5; 11 -1.365,-1.5; 12 -1.365,-1; 13 -1.365,-0.5; 14 -1.365,0; 15 -1.365,0.5; 16 -1.365,1; 17 -1.365,1.5 | smd 0.3 x 0.87: 8 0.5,-2.115; 9 0,-2.115; 10 -0.5,-2.115; 18 -0.5,2.115; 19 0,2.115; 20 0.5,2.115
SOT23-5L = smd 0.55 x 1.2: 1 -0.95,-1.3; 2 0,-1.3; 3 0.95,-1.3; 4 0.95,1.3; 5 -0.95,1.3
SOT223 = smd 1.499 x 2.007: 1 -2.261,-3.15; 2 0.025,-3.15; 3 2.311,-3.15 | smd 3.81 x 2.007: 4 0,3.15
ANT_MIFA_R = smd 0.508 x 0.508: ANT -7.188,-0.508 | drill 0.3 pad 0.508: GND -0.254,0.254
ANT_MIFA_L = smd 0.508 x 0.508: ANT 7.188,-0.508 | drill 0.3 pad 0.508: GND 0.254,0.254
ABM3B = smd 1.8 x 1.2: 1 -2,-1.2; 2 2,-1.2; 3 2,1.2; 4 -2,1.2
FA-20H = smd 1.2 x 1.1: 1 -0.85,-0.7; 2 0.85,-0.7; 3 0.85,0.7; 4 -0.85,0.7
3.2X1.5 = smd 1 x 1.8: 1 -1.275,0; 2 1.275,0

### Placement (x,y rotation side)
C1  24.29,33.43 90 top
C2  37.75,33.56 90 top
C3  30.38,36.35 270 top
C4  20.22,28.98 90 top
C5  21.87,28.98 90 top
C6  37.62,29.49 270 top
C7  39.27,29.49 270 top
C8  23.65,17.93 270 top
C9  36.35,17.93 270 top
C10  24.92,47.4 90 top
C11  22.25,50.57 90 top
C12  15.52,41.68 270 top
C13  11.84,50.57 180 top
C14  11.84,44.99 180 top
C15  16.54,50.07 90 top
C16  13.74,48.67 90 top
C17  19.46,41.3 180 top
C18  19.46,40.16 180 top
C19  41.3,50.96 270 top
C20  46.51,44.99 180 top
C21  46.51,40.92 0 top
C22  40.03,50.96 90 top
C23  36.22,47.4 90 top
C24  44.22,48.8 0 top
C25  40.03,36.73 0 top
C26  24.92,11.58 90 top
C27  26.95,11.58 90 top
C28  10.94,34.3 270 top
C29  44.35,19.71 270 top
C30  20.6,2.69 270 top
C31  40.67,11.97 0 top
C32  40.67,10.44 0 top
C33  50.32,10.95 0 top
C34  45.49,7.52 90 top
D1  45.49,3.2 270 top
EXT-1  55.4,30 90 bottom
EXT-2  4.6,30 90 bottom
J1  30,1.45 0 top
J2  12.86,8.41 90 bottom
J3  7.14,50.32 270 bottom
JP1  7.77,2.06 0 top
JP2  52.23,48.67 0 top
L1  22.63,33.43 90 top
LED  30,47.53 90 top
ON  36.35,11.33 0 top
Q1  20.6,9.04 270 top
Q2  39.65,18.57 270 top
Q3  23.27,3.96 90 top
R1  23.78,41.81 270 top
R2  15.14,50.07 270 top
R3  11.71,41.81 90 top
R4  12.98,41.81 90 top
R5  44.86,47.02 0 top
R6  19.71,22.13 180 top
R7  19.71,20.48 180 top
R8  30,42.07 90 top
R9  27.97,42.07 90 top
R10  32.03,42.07 90 top
R11  36.35,8.28 270 top
R12  2.06,36.35 270 top
R13  41.3,16.03 0 top
R14  41.3,21.11 0 top
R15  57.94,36.35 270 top
R16  19.84,11.58 0 top
R17  17.3,9.04 90 top
R18  14.76,11.58 0 top
R19  10.95,11.58 0 top
R20  12.47,1.68 0 top
R21  19.84,6.5 0 top
R22  23.27,6.5 0 top
RESET/BOOT  1.6,30 270 top
SWD  30,53.5 180 bottom
U1  30,24.92 180 top
U2  19.46,45.49 90 top
U3  19.46,51.21 270 top
U4  40.03,46.13 270 top
U5  40.03,40.16 90 top
U6  30,11.33 180 top
U7  16.92,2.69 90 top
U8  40.67,5.23 180 top
U9  50.32,5.23 180 top
U$1  48.42,52.86 0 top
U$2  11.58,52.86 0 top
USER  58.4,30 90 top
Y1  34.06,34.83 180 top
Y2  24.29,50.57 90 top
Y3  11.84,47.78 270 top
Y4  46.51,42.95 0 top

### Tracks (layer width: path | path; a pad name or v marks a point on that pad's centre or on a via)
0  (via drill 0.3)
  Top 0.254: U1.37 28.25,16.26 29.11,15.39 v31.02,15.39
  Bottom 0.254: EXT-1.5 52.23,15.39 v31.02,15.39
1  (via drill 0.3)
  Top 0.254: U1.38 28.75,16.64 29.36,16.03 v30.25,16.03
  Bottom 0.254: EXT-1.6 50.32,16.03 v30.25,16.03
2  (via drill 0.3)
  Top 0.254: U1.39 29.25,17.03 29.62,16.66 v31.02,16.66
  Bottom 0.254: EXT-1.7 48.42,16.66 v31.02,16.66
3  (via drill 0.3)
  Top 0.254: U1.40 29.75,17.42 29.87,17.3 v30.25,17.3
  Bottom 0.254: EXT-1.8 46.51,17.3 v30.25,17.3
4  (via drill 0.3)
  Top 0.254: U1.41 30.25,18.19 30.51,17.93 v31.02,17.93
  Bottom 0.254: EXT-1.9 44.61,17.93 v31.02,17.93
5
  Top 0.254: EXT-1.10 46.3,22.17 U1.51
6
  Top 0.254: U1.52 45.91,22.67 54.26,31.02 54.26,32.67 EXT-1.11
7
  Top 0.254: EXT-1.12 53.62,34.57 53.62,31.27 45.52,23.17 U1.53
8
  Top 0.254: EXT-1.13 52.99,36.48 52.99,31.52 45.13,23.67 U1.54
9  (via drill 0.3)
  Top 0.254: EXT-1.14 52.35,38.38 52.35,31.78 44.99,24.41 v39.14,24.41 | U1.43 31.25,20.07 v31.52,20.35
  Bottom 0.254: v31.52,20.35 32.16,20.98 35.72,20.98 v39.14,24.41
10  (via drill 0.3)
  Top 0.254: EXT-1.15 51.72,40.29 51.72,32.03 44.99,25.3 v39.14,25.3 | U1.50 34.65,21.67 v34.57,21.75
  Bottom 0.254: v34.57,21.75 35.46,21.75 39.02,25.3 v39.14,25.3
11
  Top 0.254: EXT-1.16 51.08,42.19 51.08,32.29 45.97,27.17 U1.61
12
  Top 0.254: EXT-1.17 50.45,44.1 50.45,32.54 45.58,27.67 U1.62
13  (via drill 0.3)
  Top 0.254: U1.55 34.18,24.17 32.39,22.38 v25.68,22.38
  Bottom 0.254: v25.68,22.38 6.89,41.18 6.89,46.76 EXT-2.17
14
  Top 0.254: U1.8 30.25,33.43 25.68,38 11.33,38 5.74,43.59 5.74,45.37 EXT-2.16
15
  Top 0.254: EXT-2.15 11.08,37.49 25.43,37.49 29.75,33.17 U1.9
16
  Top 0.254: EXT-2.14 9.04,36.99 25.17,36.99 29.25,32.91 U1.10
17
  Top 0.254: EXT-2.13 7.01,36.48 24.92,36.48 28.75,32.65 U1.11
18
  Top 0.254: U1.16 24.38,30.67 23.52,31.52 9.43,31.52 EXT-2.12
19
  Top 0.254: U1.17 24.25,29.91 23.27,30.89 7.52,30.89 EXT-2.11
20
  Top 0.254: U1.20 8.7,27.17 EXT-2.10
21
  Top 0.254: U1.21 6.66,26.67 EXT-2.9
22
  Top 0.254: U1.22 4.62,26.17 EXT-2.8
23
  Top 0.254: U1.23 6.62,25.67 EXT-2.7
24
  Top 0.254: U1.24 8.66,25.17 EXT-2.6
25
  Top 0.254: U1.25 10.7,24.67 EXT-2.5
+3V3  (via drill 0.3)
  Top 0.152: U4.29 U4.30
  Top 0.254: U1.48 33.75,20.41 32.99,21.17 24.79,21.17 | 24.79,21.17 U1.32 24.58,20.84 | EXT-1.3 57.52,15.61 USER.1 | U1.19 22.34,27.67 C5.1 | U1.1 34.08,30.34 C6.1 35.95,28.67 U1.64 | U6.13 30.5,11.83 29.5,10.83 U6.3 26.92,10.83 26.95,10.8 C27.1 | C7.1 39.36,30.25 | LED.4 30.89,46.99 v30.89,46.13 | U2.21 21.94,48.29 23.4,48.29 v23.52,48.16 | U2.27 18.71,49.43 | U2.24 20.21,49.42 v20.48,49.69 | U2.31 15.63,47.74 | U2.39 15.93,43.74 v15.39,43.21 | U4.3 U4.4 40.28,50.06 C22.1 | 36.72,46.88 36.48,46.64 | U4.14 36.72,45.38 v36.48,45.62 | C23.1 36.35,46.88 36.72,46.88 | 36.72,46.88 U4.11 | C24.1 43.43,48.65 U4.1 41.8,48.67 v42.7,48.67 | U4.17 38.27,43.59 v36.48,43.59 | v23.65,13.49 24.58,14.42 24.58,20.95 24.79,21.17 | 28.51,12.83 U6.7 v27.97,13.49 | R6.2 R7.2 v12.86,20.48 | R13.2 42.45,16.03 42.57,16.16 | R12.2 2.06,34.57 4.09,32.54 4.98,32.54 7.27,30.25 11.71,30.25 v12.86,29.11 | U8.3 37.41,7.43 R11.2
  Top 0.305: U2.10 21.71,41.65 v21.58,41.52
  Top 0.61: C5.1 C4.1 20.18,28.09 v12.86,28.09 v12.86,29.11 13.87,28.09 | C7.1 C6.1 | C27.1 C26.1 24.5,10.73 23.65,11.58 23.65,12.47 | v41.81,13.49 EXT-1.3 | v42.57,19.97 42.57,16.16 42.57,15.27 41.81,14.51 | v12.86,20.48 v12.86,19.46 | v21.58,41.52 21.36,41.3 C17.1 C18.1 20.22,40.05 20.22,40.03 | v15.65,47.96 15.65,47.92 13.84,47.92 C16.1 | v36.48,45.62 36.48,46.64 | 36.86,38.26 U5.8 38.94,36.73 C25.1 39.38,35.86 | 36.86,38.26 36.22,38.26 | 36.22,38.26 35.72,38.76 35.72,42.83 v36.48,43.59 | v39.53,49.69 v40.29,49.69 40.03,49.94 C22.1 | 41.56,30.25 v42.57,29.24 v42.57,30.25 39.36,30.25 | v12.86,33.3 19.2,33.3 v20.22,34.32 22.59,34.32 L1.2 | 20.22,40.03 v21.24,39.02 v20.22,39.02 20.22,40.03 | 23.65,12.47 v23.65,13.49 v22.63,13.49 23.65,12.47 | 36.22,38.26 39.4,35.08 v42.57,35.08 | 40.03,35.08 36.86,38.26 | 42.19,13.49 v41.81,13.49 | 41.81,14.51 v40.8,13.49 | v41.81,13.49 41.81,14.51
  Top 0.813: U8.3 38.36,8.98 C32.1 C31.1 39.82,12.51 v40.8,13.49 v41.81,13.49
  Bottom 0.254: 20.48,48.42 20.6,48.29 | v30.89,46.13 33.43,43.59 35.84,43.59
  Bottom 0.406: v15.39,43.21 15.39,42.83 16.16,42.07 21.04,42.07 v21.58,41.52 | v20.48,49.69 18.44,49.69 v18.32,49.56
  Bottom 0.61: EXT-2.3 12.22,13.49 | 12.22,13.49 12.86,13.49 | 12.86,13.49 13.49,13.49 | 13.49,13.49 v22.63,13.49 v27.97,13.49 v40.8,13.49 v41.81,13.49 | v12.86,33.3 v12.86,29.11 v12.86,28.09 v12.86,20.48 v12.86,19.46 12.86,14.12 | 12.86,14.12 12.86,13.49 | 20.22,35.33 v20.22,34.32 v21.24,34.32 20.22,35.33 | 20.22,35.33 20.22,38 | 23.14,48.29 23.14,43.08 v21.58,41.52 | 23.14,48.29 20.6,48.29 19.59,48.29 v18.32,49.56 v17.68,49.56 17.25,49.56 v15.65,47.96 | v36.48,43.59 36.48,44.22 | 36.48,44.22 v36.48,45.62 36.48,47.35 38.81,49.69 v40.29,49.69 41.3,48.67 v42.7,48.67 43.34,48.03 v43.34,46.64 | v36.48,43.59 v35.84,42.95 35.84,43.59 | 23.14,48.29 23.4,48.29 v23.52,48.16 | 20.22,38 v21.24,39.02 v20.22,39.02 20.22,38 | 42.57,34.06 v41.56,35.08 v42.57,35.08 v42.57,30.25 v42.57,19.97 v42.57,18.95 | 12.86,14.12 12.22,13.49 | 12.86,14.12 13.49,13.49 | 35.84,43.59 v36.48,43.59 | 36.48,44.22 35.84,43.59
  pour Top (isolate 0.254, no thermals): 16.41,49.94 18.32,49.94 18.7,49.56 18.7,48.16 17.68,48.16 17.68,49.05 17.43,49.3 16.41,49.3
  pour Top (isolate 0.254, no thermals): 13.36,48.16 16.28,48.16 16.79,47.65 13.36,47.65
  pour Top (isolate 0.254, no thermals): 39.27,50.07 40.92,50.07 40.92,48.29 39.27,48.29
  pour Top (isolate 0.254, no thermals): 42.07,47.02 42.07,46.26 43.59,46.26 43.59,47.02
  pour Top (isolate 0.254, no thermals): 41.68,48.92 42.07,49.3 43.84,49.3 43.84,48.16 41.68,48.16
+5V  (via drill 0.3)
  Top 0.254: 16.03,3.58 16.03,3.65 U7.4
  Top 0.61: 49.81,6.12 49.27,6.67 49.22,6.67 | C34.1 49.22,6.67 | 49.22,6.67 50.3,7.75 U9.2 | U9.4 v47.78,2.08 45.51,2.08 D1.A | 14.99,3.58 17.92,6.52 | 17.92,6.52 Q1.2 | 15.62,3.58 U7.4 15.62,4.22 | 14.99,3.58 v14.25,3.58 v13.24,3.58 12.09,3.58 6.76,8.92 6.76,13.87 EXT-2.4 | 14.99,3.58 16.03,3.58 16.03,4.6 | R21.1 17.93,6.5 17.92,6.52
  Top 1.5: U9.2 50.3,2.11 U9.4
  Bottom 0.61: 14.63,3.2 v14.25,3.58 v13.24,3.58 13.62,3.2 14.63,3.2 | v47.78,2.08 v46.76,2.08 45.65,3.2 14.63,3.2
BAT_METER
  Top 0.254: R18.1 R19.2 11.84,11.62 11.84,20.73 14.78,23.67 U1.27
BOOT0  (via drill 0.3)
  Top 0.254: U1.60 43.36,26.67 v43.59,26.44 | R14.2 43.21,21.11 v43.59,21.49 44.35,20.73 C29.1 48.88,16.03 EXT-1.4
  Bottom 0.254: v43.59,26.44 v43.59,21.49
BT_ANT
  Top 0.254: U$2.ANT 18.9,52.35 18.9,51.86 U3.1 18.57,51.84 18.65,51.84 18.65,52.35
BT_DC  (via drill 0.3)
  Top 0.254: U1.35 27.25,20.18 v26.95,20.48 | v12.6,38.89 12.6,40.16 11.71,41.05 R3.1
  Bottom 0.254: v12.6,38.89 12.6,36.35 26.95,22 v26.95,20.48
BT_DD  (via drill 0.3)
  Top 0.254: U1.36 27.75,20.38 v27.84,20.48 | v13.24,39.53 13.24,40.91 R4.1
  Bottom 0.254: v13.24,39.53 13.24,36.6 27.84,22 v27.84,20.48
BT_RST  (via drill 0.3)
  Top 0.254: R1.2 23.78,41.05 v26.32,38.51 | U1.4 v32.25,29.53
  Bottom 0.254: v26.32,38.51 27.97,38.51 32.25,34.23 v32.25,29.53
BT_RX  (via drill 0.3)
  Top 0.254: v14.51,39.53 14.51,43.34 15.41,44.24 U2.38 | v27.71,23.9 28.09,23.52 31.9,23.52 34.55,26.17 U1.59
  Bottom 0.254: v27.71,23.9 14.51,37.11 v14.51,39.53
BT_TX  (via drill 0.3)
  Top 0.254: v13.87,38.89 13.87,43.46 15.15,44.74 U2.37 | U1.58 34.81,25.67 32.16,23.02 v27.71,23.02
  Bottom 0.254: v27.71,23.02 13.87,36.86 v13.87,38.89
GND  (via drill 0.3)
  Top 0.152: Y2.4 23.59,49.87 24.98,51.27 Y2.2 | Y4.4 45.81,43.65 47.21,42.25 Y4.2
  Top 0.254: U4.13 38.66,45.88 U4.EXP@10 | C21.2 47.36,41.12 Y4.2 | Y4.4 45.66,44.79 C20.2 v44.99,44.99 | C11.1 22.45,49.72 Y2.4 | 16.52,41.03 v16.54,41.05 | 10.1,8.41 J2.- 11.58,6.89 12.09,6.38 14.38,6.38 16.2,8.2 R17.1 | C5.2 21.87,29.75 23.45,28.17 U1.18 25.38,28.17 v25.43,28.22 | 37.15,28.17 37.18,28.2 | 37.18,28.2 C6.2 | C26.2 C27.2 | 26.93,12.33 U6.6 29.62,12.33 | 29.62,12.33 29.62,11.71 29.24,11.33 U6.4 27.84,11.33 | U5.4 v43.97,42.07 | v48.03,40.92 47.15,40.92 | R15.1 57.94,39.53 v58.58,40.16 | v23.65,16.03 C8.2 23.64,17.09 23.64,17.07 | C18.2 v17.93,40.16 | v17.93,41.3 18.82,41.3 18.82,40.16 | C23.2 v36.22,48.92 | C22.2 40.02,51.59 v39.27,51.59 | v45.75,48.8 44.86,48.8 | 36.68,28.17 37.18,28.67 | 37.18,28.67 37.37,28.86 | 37.18,28.2 37.18,28.67 | C10.1 v24.92,45.88 | v1.43,30 2.48,28.94 RESET/BOOT.2 | R20.1 v10.31,1.68 | 31.4,9.81 31.36,9.81 31.36,8.76 30.51,7.9 v30,7.9 29.5,8.4 U6.20 29.5,10.07 29.75,10.31 v30,10.31 | U6.17 32.16,9.83 32.41,10.08 32.41,12.08 32.16,12.33 | 29.62,12.33 U6.12 32.16,12.33 | C15.2 v16.54,51.59 | v13.74,50.32 13.74,49.3 | C1.2 25.98,34.28 28.25,32 U1.12 28.25,25.84 25.58,23.17 U1.28 16.95,23.17 v16.03,22.25 v15.01,22.25 | v34.57,28.22 34.62,28.17 U1.63 37.18,28.17 37.18,28.2 | R22.2 v25.3,6.5 | C9.2 ON.C | R19.1 8.66,11.58 7.77,10.7 v7.77,9.68 | Q2.2 38.55,14.97 v39.02,14.51 | C29.2 44.35,15.65 45.49,14.51 v51.59,14.51 | C28.2 9.53,33.45 8.66,34.32 v8.66,34.95 v7.65,34.95 | 32.16,12.33 32.41,12.58 32.41,14.12 v32.03,14.51
  Top 0.305: U2.1 17.21,43.02 17.93,43.74 U2.EXP@1
  Top 0.35: U3.5 U3.2 17.93,51.21 v17.55,51.59 | U3.5 U3.6 | U3.5 v21.11,51.21
  Top 0.406: R5.2 v46.38,47.02 | C12.2 16.52,41.03 | J1.SH6 31.3,4.45 J1.5 | 31.3,5.39 31.3,1.6 J1.SH3 | 37.62,32.79 40.92,32.79 v41.18,33.05 | C2.1 37.73,32.91 37.62,32.79 | v32.79,34.83 32.79,35.72 32.48,36.03 Y1.2 31.09,37 C3.1 30.38,38.13 v30.25,38.26 | C25.2 v41.56,36.73 | Y1.4 36.9,32.79 37.62,32.79 | v23.27,29.87 23.23,29.83 C5.2 C4.2 16.07,29.83 v16.03,29.87 v15.01,29.87
  Top 0.508: SWD.1 v26.19,51.59
  Top 0.61: 19.84,1.93 19.93,1.84 C30.2 | 52.61,8.41 U9.1 | C34.2 v45.49,9.55 | C6.2 37.33,28.35 | 37.33,28.35 37.11,28.35 | 37.33,28.35 39.4,28.35 | 39.4,28.35 43.46,28.35 v44.99,29.87 v43.97,29.87 | C7.2 39.27,28.48 39.4,28.35 | v27.33,0.66 v27.33,2.19 | v32.67,0.66 v32.67,2.19 | 24.41,1.45 J1.SH3 35.46,1.45 | U7.2 19.08,2.69 19.84,1.93 | 19.84,1.93 20.6,1.93 v20.6,0.66
  Top 0.813: EXT-1.1 52.61,8.41 | 52.58,10.19 C33.- | C31.2 C32.2 41.52,10.02 40.64,9.15 U8.2 | U9.1 52.58,9.96 51.84,10.7
  Top 1.016: J2.- 9.81,8.41
  Top 1.5: U8.2 40.64,2.11 U8.4
  Bottom 0.254: v16.54,41.05 16.92,41.05 | v43.97,42.07 44.22,42.07 | v36.22,48.92 36.22,49.18 | v39.27,51.59 39.14,51.59
  Bottom 0.508: v52.61,14.51 v51.59,14.51 51.59,8.41
  Bottom 0.61: EXT-2.1 2.69,8.41 v1.43,9.68 | v1.43,50.32 2.69,51.59 EXT-2.18 J3.1 J3.2 | v58.58,9.68 57.31,8.41 EXT-1.1 51.59,8.41 46.64,8.41 v45.49,9.55 | v58.58,50.32 57.31,51.59 EXT-1.18 | v27.33,0.66 v32.67,0.66
  Bottom 0.914: U$2.GND 6.12,53.11 EXT-2.18 | EXT-1.18 53.88,53.11 U$1.GND
  Bottom 1.016: J2.- EXT-2.1
  other vias: 58.58,45.24 58.58,30 58.58,24.92 58.58,19.84 58.58,14.76 1.43,14.76 1.43,19.84 1.43,24.92 1.43,40.16 1.43,45.24 25.55,34.32 33.68,6.5 34.7,6.5 7.39,14.76 8.41,14.76 36.35,14.51 25.94,12.47 15.52,51.59 42.45,51.59 43.46,51.59 44.48,51.59 45.49,51.59 46.51,51.59 47.53,51.59 48.54,51.59 42.45,50.57 37.24,51.59 36.22,51.59 49.56,51.59 35.21,51.59 35.21,50.57 49.56,50.57 49.56,49.56 49.56,48.54 49.56,47.53 49.56,46.51 49.56,45.49 49.56,44.48 49.56,43.46 49.56,42.45 49.56,41.43 38.76,50.57 26.19,47.53 26.19,46.51 26.19,45.49 26.19,44.48 26.19,43.46 26.19,42.45 10.44,51.59 10.44,50.57 10.44,49.56 10.44,48.54 10.44,47.53 10.44,46.51 10.44,45.49 10.44,44.48 10.44,43.46 10.44,42.45 10.44,41.43 11.46,51.59 12.47,51.59 13.49,51.59 14.51,51.59 38.26,51.59 35.21,48.54 35.21,47.53 35.21,46.51 35.21,45.49 24.79,41.06 49.56,40.41 10.44,40.41 29.36,25.55 30.64,25.55 30.64,24.29 29.36,24.29 31.9,24.92 28.09,24.92 7.77,45.24 52.23,50.32 20.98,14.63 40.03,14.51 19.97,14.63 30,12.35 7.65,29.49 8.66,29.49 45.75,20.35 45.75,21.36 26.19,48.54 26.19,50.57 26.19,49.56 22.76,41.05 22,40.29 15.52,40.16 44.86,49.81 26.32,6.5 41.18,4.22 48.03,5.23 52.61,5.23 40.16,4.22 48.03,4.22 52.61,4.22 46.13,35.08 46.13,36.1 7.77,4.6 18.7,34.57 26.19,41.43 35.21,44.48 36.22,50.19 40.16,6.5 41.18,6.5 34.45,33.05
  pour Bottom (isolate 0.203, rank 2, no thermals): 9.93,53.5 9.93,39.91 26.7,39.91 26.7,52.1 19.84,52.1 19.84,53.5
  pour Bottom (isolate 0.203, rank 2, no thermals): 50.07,53.5 50.07,39.91 34.7,39.91 34.7,52.1 40.16,52.1 40.16,53.5
  pour Top (isolate 0.254, rank 2): 0.03,53.5 0.03,0.03 59.97,0.03 59.97,53.5 50.57,53.5 50.57,39.4 34.19,39.4 34.19,40.67 27.21,40.67 27.21,39.4 9.43,39.4 9.43,53.5
  pour Bottom (isolate 0.254, rank 2): -0.61,53.5 -0.61,-0.61 60.61,-0.61 60.61,53.5 50.57,53.5 50.57,39.4 34.19,39.4 34.19,40.67 27.21,40.67 27.21,39.4 9.43,39.4 9.43,53.5
  pour Top (isolate 0.203, rank 2, no thermals): 9.93,53.5 9.93,39.91 26.7,39.91 26.7,52.1 19.84,52.1 19.84,53.5
  pour Top (isolate 0.203, rank 2, no thermals): 50.07,53.5 50.07,39.91 34.7,39.91 34.7,52.1 40.16,52.1 40.16,53.5
LED_B  (via drill 0.3)
  Top 0.254: v32.41,40.16 32.03,40.54 R10.1 | U1.56 37.12,24.67 v37.87,25.43
  Bottom 0.254: v32.41,40.16 32.41,37.11 37.87,31.65 v37.87,25.43
LED_G  (via drill 0.3)
  Top 0.254: v27.97,39.78 R9.1 | U1.57 36.6,25.17 37.11,25.68 v37.11,25.94
  Bottom 0.254: v37.11,25.94 37.11,31.52 31.78,36.86 31.78,38.89 30.89,39.78 v27.97,39.78
LED_R  (via drill 0.3)
  Top 0.254: v27.08,25.68 25.57,24.17 U1.26 | v27.84,37.77 27.84,38.51 30,40.67 R8.1
  Bottom 0.254: v27.08,25.68 27.08,36.86 27.84,37.62 v27.84,37.77
N$1
  Top 0.203: 36.06,35.56 Y1.1 36.06,35.68 31.75,31.37 U1.5
  Top 0.254: C2.2 37.75,34.34 Y1.1
N$2
  Top 0.203: U1.6 31.25,32.81 Y1.3
  Top 0.254: C3.2 32.06,34.02 Y1.3
N$3
  Top 0.254: U2.32 13.14,47.24 12.49,47.89 12.49,49.05 | 12.49,49.05 C13.1 | Y3.1 12.48,49.06 12.49,49.05
N$4
  Top 0.254: R8.2 30,46.28 LED.1
N$5
  Top 0.254: U1.31 23.45,21.67 23.14,21.36 23.14,19.33 23.65,18.82 C8.1
N$6
  Top 0.254: U1.47 33.25,18.37 33.68,17.93 35.5,17.93 C9.1
N$7
  Top 0.254: R9.2 27.97,47.4 28.54,47.98 LED.2
N$8
  Top 0.254: R10.2 32.03,47.4 31.45,47.98 LED.3
N$9
  Top 0.254: U1.13 27.75,31.74 26.91,32.58 C1.1
  Top 0.406: L1.1 C1.1
N$10
  Top 0.203: U4.31 44.21,47.38 R5.1
N$11
  Top 0.203: U4.27 43.83,45.38 44.35,44.86 44.35,43.08 45.18,42.25 Y4.1
  Top 0.254: C21.1 45.66,41.12 Y4.1
N$12
  Top 0.254: U2.26 19.21,49.93 U3.3
N$13
  Top 0.254: U2.30 16.04,48.52 R2.2
N$14
  Top 0.152: U2.40
  Top 0.254: U2.40 C12.1
N$15
  Top 0.254: U2.25 19.71,49.93 U3.4
N$16
  Top 0.254: R3.2 11.71,42.83 15.13,46.24 U2.34
N$17
  Top 0.203: U4.28 46.76,45.88 47.16,45.48 C20.1
  Top 0.254: C20.1 47.36,44.79 Y4.3
N$18
  Top 0.254: U7.5 15.55,1.68 R20.2
N$19
  Top 0.152: U2.22 21.21,49.02 21.47,49.28 22.15,49.28 22.63,48.8 24.54,48.8 24.98,49.24 Y2.1
  Top 0.254: C10.2 24.92,49.66 Y2.1
N$20
  Top 0.152: U2.23 20.73,48.54 20.73,49.05 21.49,49.81 21.49,50.7 22.01,51.22 C11.2
  Top 0.254: C11.2 22.45,51.42 Y2.3
N$21
  Top 0.254: R4.2 12.98,43.34 15.39,45.74 U2.35
N$22
  Top 0.254: U2.20 23.05,47.74 23.78,47.02 R1.1
N$23
  Top 0.254: 41.28,50.29 C19.2
  Top 0.3: U4.2 41.28,50.29
N$24
  Top 0.254: U2.33 11.98,46.74 11.84,46.6 Y3.2 11.87,46.48 12.49,46.48 C14.1
N$25
  Top 0.254: ON.A R11.1
N$26
  Top 0.254: R17.2 17.4,9.99 Q1.1 18.99,9.99 R16.1
N$27
  Top 0.254: R13.1 40.45,18.27 Q2.3 40.45,18.87 R14.1
N$28
  Top 0.254: R21.2 R22.1 23.27,5.65 23.27,4.12 Q3.1
NRST  (via drill 0.3)
  Top 0.254: RESET/BOOT.1 2.06,32.53 2.06,33.68 1.04,34.7 1.04,36.18 R12.1 2.48,37.62 4.98,37.62 6.89,35.72 10.95,35.72 | SWD.2 28.73,49.18 26.95,47.4 v26.95,37.77 26.95,37.75 30.75,33.95 U1.7 30.75,29.38 v33.3,26.82 | v24.67,35.72 10.95,35.72 | Q2.1 38.11,19.97 35.08,19.97 33.3,21.75 v33.3,22.38 | C28.1 10.95,35.72
  Bottom 0.254: v24.67,35.72 24.89,35.72 v26.95,37.77 | v33.3,26.82 v33.3,22.38
SCL  (via drill 0.3)
  Top 0.254: U6.9 30,14 29.75,14.25 26.06,14.25 v25.94,14.38 | R6.1 v21.49,22.13 22.04,22.67 U1.29
  Bottom 0.254: v25.94,14.38 23.27,14.38 20.6,17.05 20.6,21.24 v21.49,22.13
SD_CLK  (via drill 0.3)
  Top 0.152: 37.72,40.8 U5.6
  Top 0.203: U4.21 40.28,41.63 v40.21,41.56 | v38.2,41.28 37.72,40.8
  Bottom 0.203: v40.21,41.56 38.48,41.56 v38.2,41.28
SD_CMD
  Top 0.152: 42.19,38.26 U5.1 40.52,38.26 40.06,38.71 40.06,40.92 39.65,41.33 39.65,41.89 39.78,42.02 U4.20
SD_D0
  Top 0.152: U4.22 40.78,39.79 41.05,39.53 U5.2
SD_D1  (via drill 0.3)
  Top 0.203: v37.49,42.83 37.42,42.75 U5.5 | U4.23 41.28,42.89 v41.34,42.83
  Bottom 0.203: v41.34,42.83 v37.49,42.83
SD_D2
  Top 0.152: U4.18 38.78,39.8 38.51,39.53 U5.7
SD_D3  (via drill 0.3)
  Top 0.152: U4.19 39.28,40.86 v39.35,40.8
  Top 0.203: v41.35,40.8 U5.3
  Bottom 0.203: v39.35,40.8 v41.35,40.8
SDA  (via drill 0.3)
  Top 0.254: U6.11 31.36,13.78 30.38,14.76 28.09,14.76 v27.84,15.01 | R7.1 v21.49,20.48 23.19,22.17 U1.30
  Bottom 0.254: v21.49,20.48 21.11,20.09 21.11,17.3 23.4,15.01 v27.84,15.01
SW1  (via drill 0.3)
  Top 0.254: USER.2 57.94,32.53 R15.2 57.52,35.08 v56.42,35.08 | U1.2 33.25,31.37 33.53,31.65 v46.51,31.65
  Bottom 0.254: v46.51,31.65 49.94,35.08 v56.42,35.08
SWCLK  (via drill 0.3)
  Top 0.254: v33.68,40.16 33.68,53.37 SWD.4 | U1.49 37.93,21.17 v38,21.24
  Bottom 0.254: v33.68,40.16 33.68,37.62 40.54,30.76 40.54,23.78 v38,21.24
SWDIO  (via drill 0.3)
  Top 0.254: U1.46 32.75,20.3 v32.79,20.35 | SWD.3 31.27,49.18 33.05,47.4 v33.05,39.53
  Bottom 0.254: v33.05,39.53 33.05,37.37 39.91,30.51 39.91,24.16 36.1,20.35 v32.79,20.35
USB_DM
  Top 0.254: J1.2 29.35,5.35 33.05,9.04 33.05,15.9 31.75,17.2 U1.44
USB_DP
  Top 0.254: J1.3 30,5.23 33.56,8.79 33.56,16.16 32.25,17.46 U1.45
V+  (via drill 0.3)
  Top 0.254: R18.2 15.61,9.89 J2.+
  Top 0.61: U7.3 20.6,3.65 | 20.6,3.65 C30.1 21.02,3.96 Q3.3 | 20.6,3.65 v20.6,4.85 20.48,4.85 | 20.48,4.85 v19.59,4.85 19.97,4.85 20.86,3.96 20.48,3.96 20.48,4.85
  Bottom 0.61: v20.6,4.85 v19.59,4.85 17.68,4.85 J2.+ 14.12,9.04 12.22,10.95 EXT-2.2
VBUS  (via drill 0.3)
  Top 0.254: 22.25,9.04 22.25,9.3 22.76,9.81 22.76,12.22 21.87,13.11 21.87,18.95 v22.38,19.46 | U1.42 30.75,20.23 v30.64,20.35
  Top 0.406: 28.7,4.63 28.7,5.52 25.17,9.04 22.25,9.04 Q1.3
  Bottom 0.254: v22.38,19.46 22.76,19.84 30.13,19.84 v30.64,20.35
  pour Top (isolate 0.254, no thermals): 21.24,9.3 25.3,9.3 28.86,5.74 28.86,4.35 28.6,4.35 28.6,5.23 25.05,8.79 21.24,8.79
VIN_3V3  (via drill 0.3)
  Top 0.61: v43.97,4.22 v42.95,4.22 42.93,4.24 U8.1 | D1.C 44.05,4.3 v43.97,4.22 | Q3.2 24.73,4.92 v25.3,5.49 v26.32,5.49 | v43.97,4.22 42.95,5.23
  Bottom 0.61: v43.97,4.22 v42.95,4.22 41.68,5.49 v26.32,5.49 v25.3,5.49
VPP  (via drill 0.3)
  Top 0.254: R16.2 v21.87,11.58 | v46.64,11.58 47.27,10.95 C33.+
  Top 0.813: U9.3 48.01,10.14 C33.+ 50.22,12.35 54,12.35 EXT-1.2
  Bottom 0.254: v21.87,11.58 v46.64,11.58
WIFI_ANT
  Top 0.508: C19.1 41.23,51.68 U$1.ANT
WIFI_MODE  (via drill 0.3)
  Top 0.254: v34.95,38.26 34.95,43.21 36.62,44.88 U4.15 | U1.34 26.75,18.39 v27.21,17.93
  Bottom 0.254: v27.21,17.93 27.84,18.57 37.37,18.57 41.81,23.02 41.81,31.27 34.95,38.13 v34.95,38.26
WIFI_PWD  (via drill 0.3)
  Top 0.254: v34.32,39.53 34.32,49.05 34.83,49.56 38.51,49.56 38.78,49.28 U4.7 | U1.33 26.25,18 v26.19,17.93
  Bottom 0.254: v34.32,39.53 34.32,37.87 41.18,31.02 41.18,23.4 36.95,19.17 27.43,19.17 v26.19,17.93
WIFI_RST
  Top 0.254: U4.32 47.17,47.88 48.8,46.26 48.8,35.46 45.49,32.16 33.3,32.16 32.75,31.61 U1.3
WIFI_RX  (via drill 0.3)
  Top 0.254: U4.26 43.19,44.88 43.46,44.61 43.46,43.84 v43.34,43.72 | U1.15 26.75,31.47 26.57,31.65 v25.43,31.65
  Bottom 0.254: v43.34,43.72 43.34,40.16 41.81,38.64 36.73,38.64 34.57,40.8 27.59,40.8 23.9,37.11 23.9,33.18 v25.43,31.65
WIFI_TX  (via drill 0.3)
  Top 0.254: v42.57,43.21 42.57,44.36 U4.25 | U1.14 27.25,29.79 26.95,29.49 v25.43,29.49
  Bottom 0.254: v42.57,43.21 42.57,40.29 41.56,39.27 36.99,39.27 34.83,41.43 27.33,41.43 23.27,37.37 23.27,31.65 v25.43,29.49

### Text on the board
Bottom: TON V1.2
tPlace: U3 | RESET | BOOT | .
bPlace: GND | NRST | SWDIO | SWCLK | GND | GND | 13 | 12 | 14 | 11 | 15 | 10 | 16 | 9 | 17 | 8 | 18 | 7 | 19 | 6 | 20 | 5 | 21 | 4 | 22 | 3 | 23 | 2 | 24 | 1 | 25 | 0 | 5V | BOOT | 3V3 | 3V3 | VBAT | VIN | LiPo 1S | GND | Licensed under CERN OHL v.1.2 | GND
tDocu: TON Board V1.2 by IOTON Technology. / Licensed under CERN OHL v.1.2. / http://ohwr.org/cernohl